# Altium project Embedded_TestBed.PrjPcb
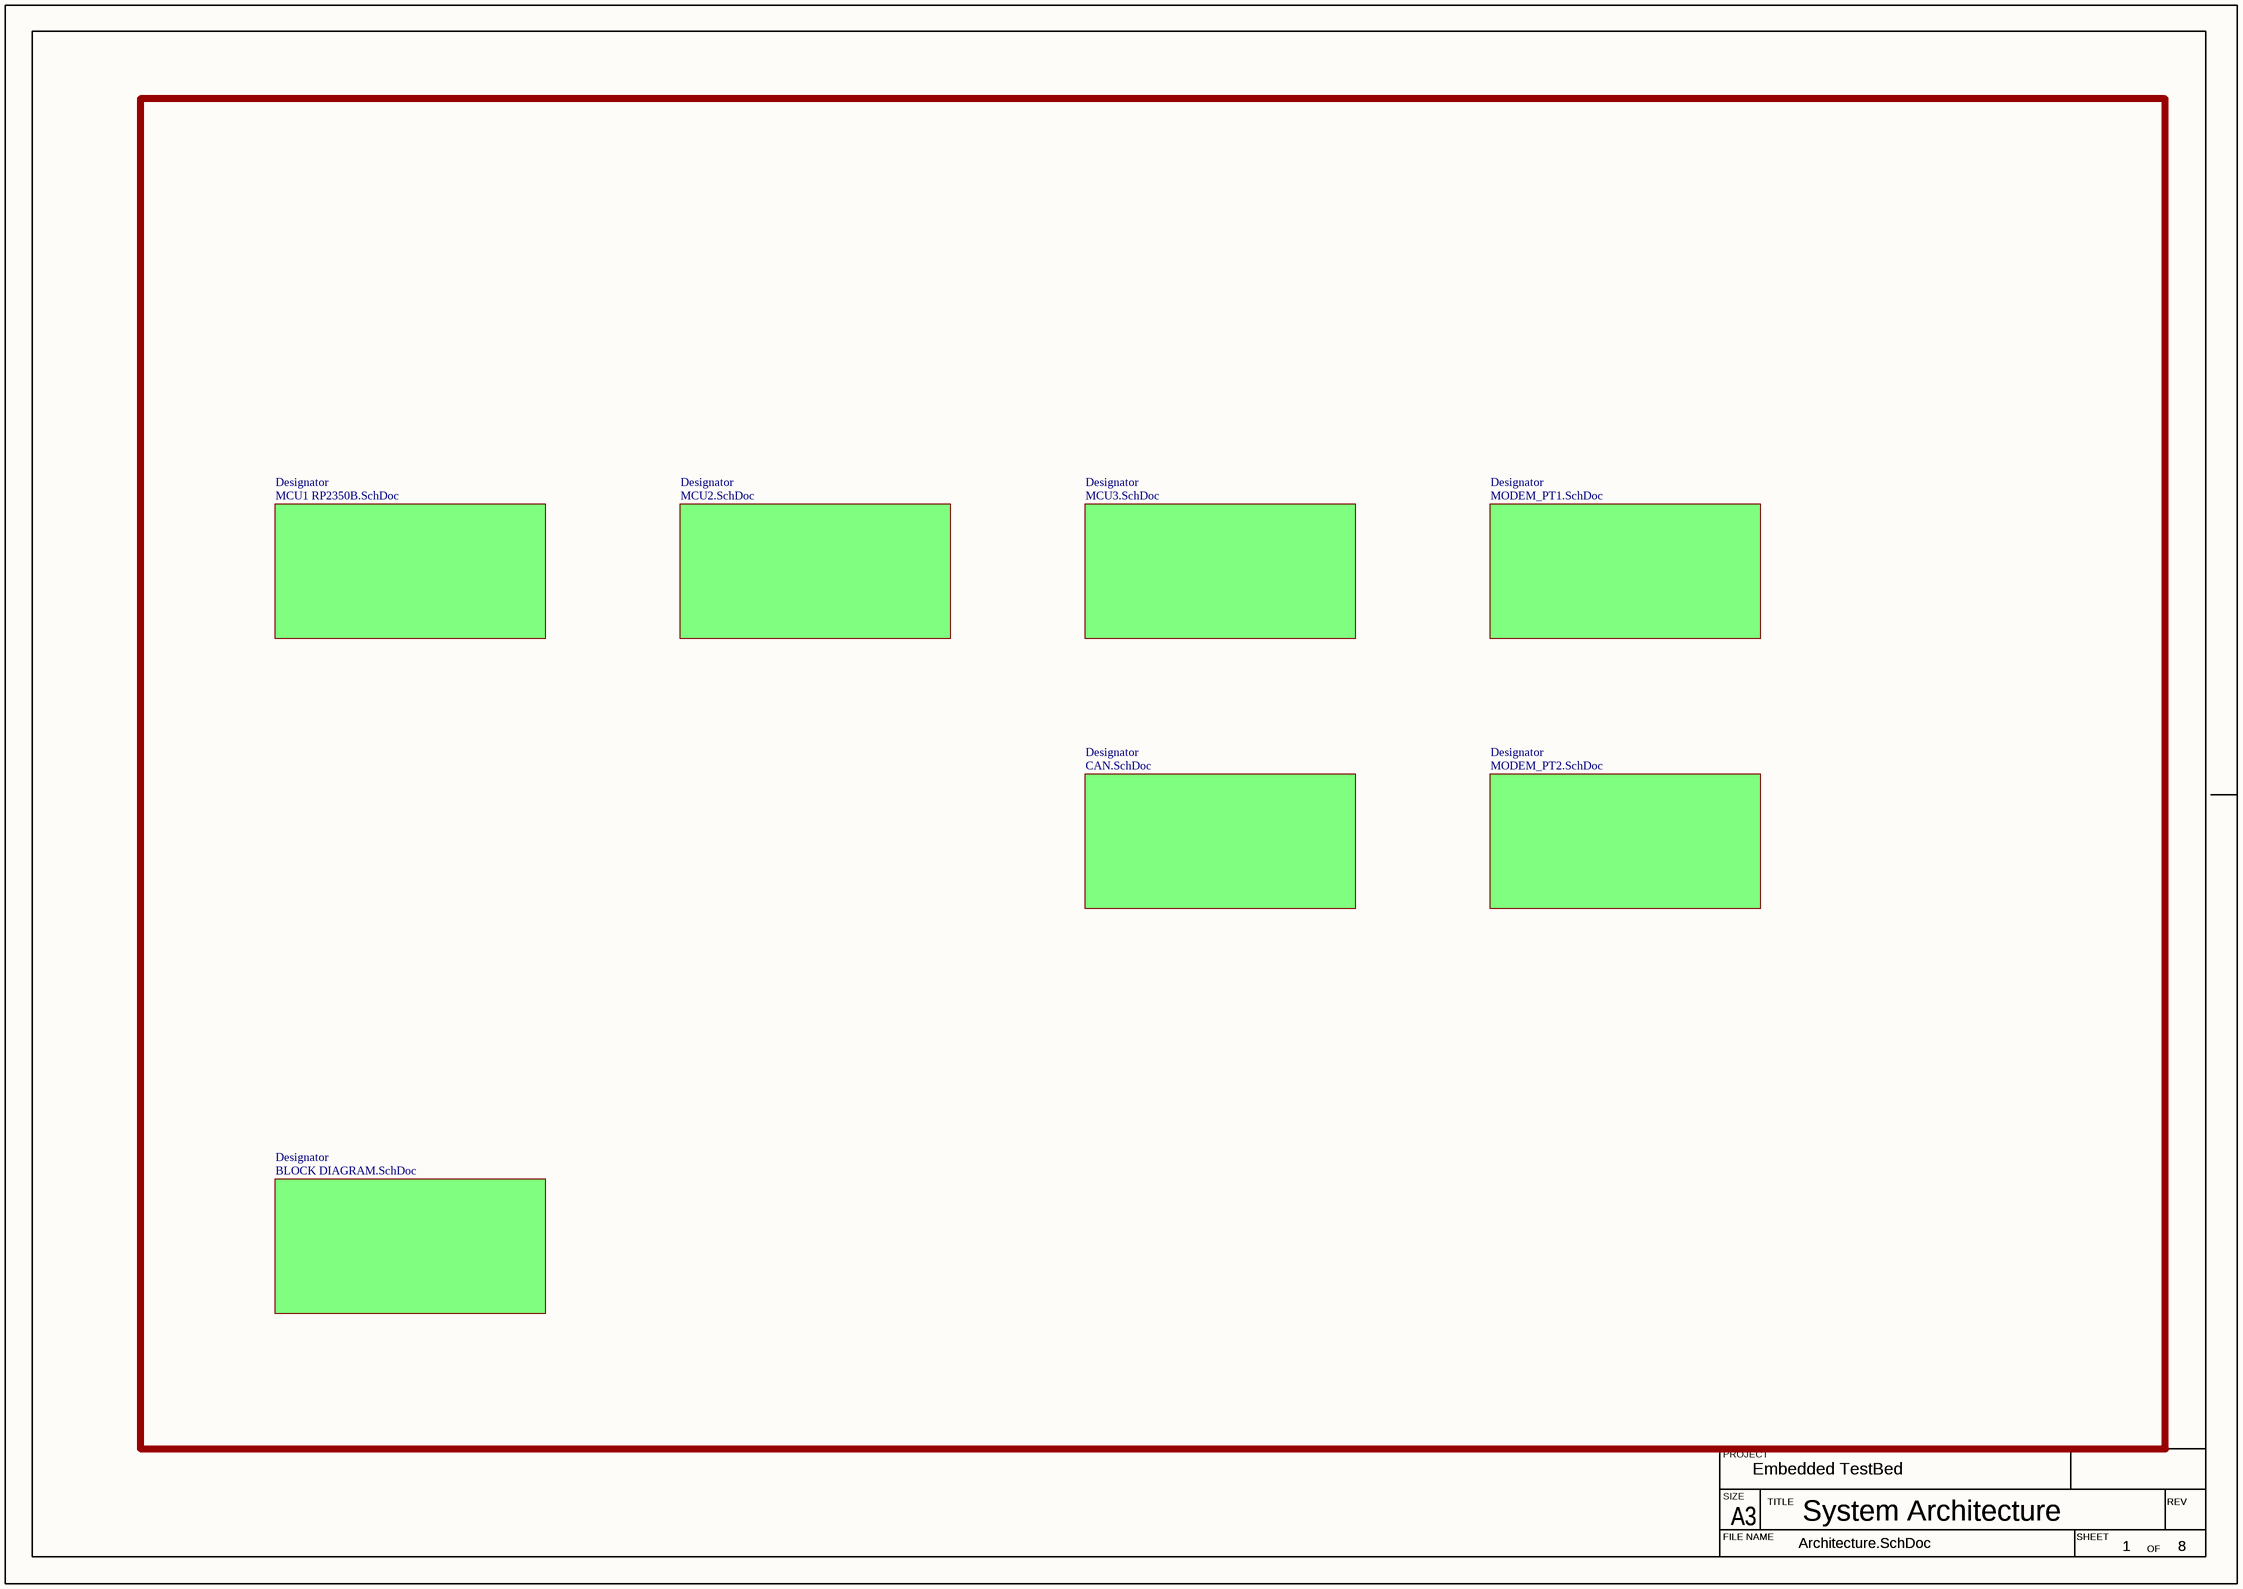
[diagram p0: Architecture.SchDoc]
Project: Embedded TestBed; Rev: 1.0
7 sheets, 141 parts. Net scope: flat (ports and power ports of the same name join across sheets).
Board file: Embedded_TestBed.PcbDoc
Sheets:
  Architecture.SchDoc
    Designator = MCU1 RP2350B.SchDoc
    Designator = MCU2.SchDoc
    Designator = MCU3.SchDoc
    Designator = MODEM_PT1.SchDoc
    Designator = MODEM_PT2.SchDoc
    Designator = CAN.SchDoc

## Sheet Architecture.SchDoc: System Architecture
size 420 x 297 mm; Revision: 1.0; SheetNumber: 1; SheetTotal: 8

### Sub-sheets
Designator = MCU1 RP2350B.SchDoc: no entries
Designator = MCU2.SchDoc: no entries
Designator = BLOCK DIAGRAM.SchDoc (file not in this document): no entries
Designator = MCU3.SchDoc: no entries
Designator = MODEM_PT1.SchDoc: no entries
Designator = MODEM_PT2.SchDoc: no entries
Designator = CAN.SchDoc: no entries

### Notes on the sheet
- PROJECT
- SIZE
- FILE NAME
- A3
- TITLE
- SHEET
- OF
- REV

## Sheet MCU1 RP2350B.SchDoc: MCU 1 - RP2350B
size 420 x 297 mm; Revision: 1.0; SheetNumber: 3; SheetTotal: 8
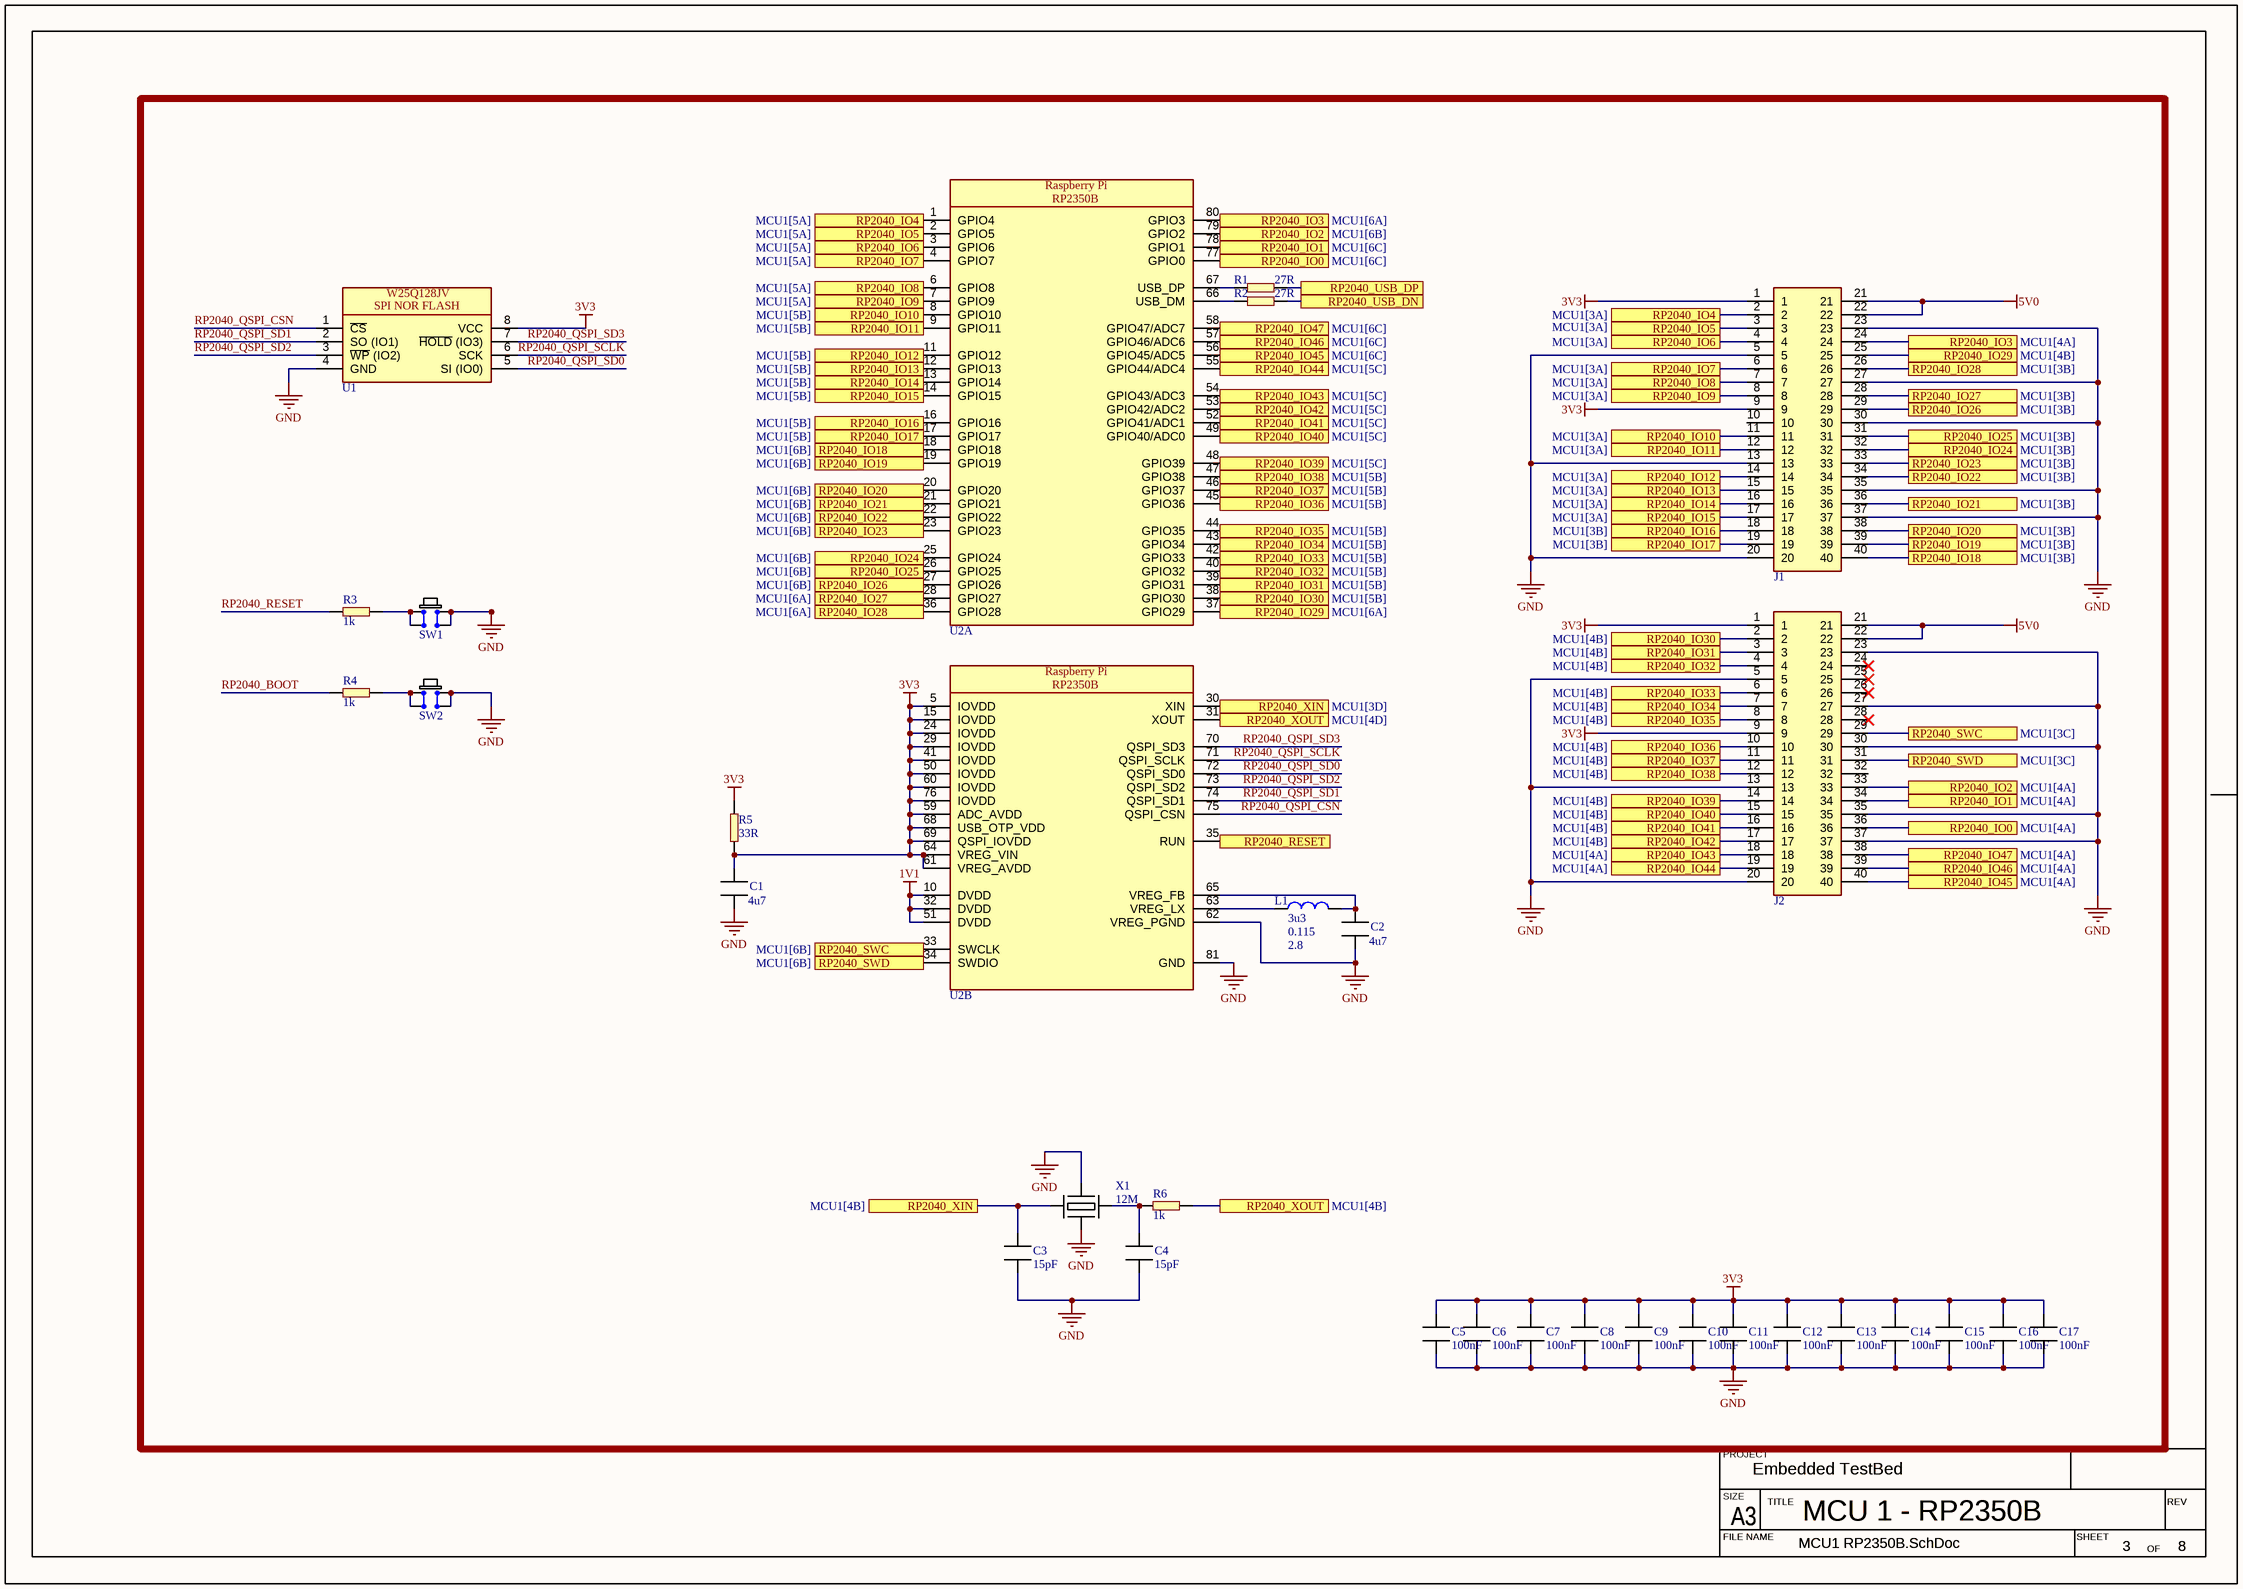
[diagram p1: MCU1 RP2350B.SchDoc]

### Parts
C1  value 4u7  [CAPC1608X10N]  (hidden comment: ERP_102-1)
C2  value 4u7  [CAPC1608X10N]  (hidden comment: ERP_102-1)
C3  value 15pF  [CAPC2012X13L]  (hidden comment: MLCC_0805)
C4  value 15pF  [CAPC2012X13L]  (hidden comment: MLCC_0805)
C5  value 100nF  [CAPC2012X13L]  (hidden comment: MLCC_0805)
C6  value 100nF  [CAPC2012X13L]  (hidden comment: MLCC_0805)
C7  value 100nF  [CAPC2012X13L]  (hidden comment: MLCC_0805)
C8  value 100nF  [CAPC2012X13L]  (hidden comment: MLCC_0805)
C9  value 100nF  [CAPC2012X13L]  (hidden comment: MLCC_0805)
C10  value 100nF  [CAPC2012X13L]  (hidden comment: MLCC_0805)
C11  value 100nF  [CAPC2012X13L]  (hidden comment: MLCC_0805)
C12  value 100nF  [CAPC2012X13L]  (hidden comment: MLCC_0805)
C13  value 100nF  [CAPC2012X13L]  (hidden comment: MLCC_0805)
C14  value 100nF  [CAPC2012X13L]  (hidden comment: MLCC_0805)
C15  value 100nF  [CAPC2012X13L]  (hidden comment: MLCC_0805)
C16  value 100nF  [CAPC2012X13L]  (hidden comment: MLCC_0805)
C17  value 100nF  [CAPC2012X13L]  (hidden comment: MLCC_0805)
J1  40PX2R_M_1  [40PX2R_Male_THT]  (value not drawn)
J2  40PX2R_M_1  [40PX2R_Male_THT]  (value not drawn)
L1  value 3u3  DCR: 0.115  ISAT: 2.8  [INDC2016X10M]  (hidden comment: AOTA-B201610S)
R1  value 27R  [RES_0805]  (hidden comment: ERP_101-1)
R2  value 27R  [RES_0805]  (hidden comment: ERP_101-1)
R3  value 1k  [RES_0805]  (hidden comment: ERP_101-1)
R4  value 1k  [RES_0805]  (hidden comment: ERP_101-1)
R5  value 33R  [RES_0603]  (hidden comment: ERP_101-1)
R6  value 1k  [RES_0805]  (hidden comment: ERP_101-1)
SW1  Generic6X6  [Generic6X6]  (value not drawn)
SW2  Generic6X6  [Generic6X6]  (value not drawn)
U1  W25Q128JV  [SOIC127P780X195-8N]  (value not drawn)
U2  RP2350B  [QFN40P1000X1000X90_HS-81M]  (value not drawn)  (parts A,B of 2)
X1  value 12M  [ABM8]  (hidden comment: ABM8)

### Ports
RP2040_IO0 (see MCU1[4A]), RP2040_IO0 (see MCU1[6C]), RP2040_IO1 (see MCU1[4A]), RP2040_IO1 (see MCU1[6C]), RP2040_IO2 (see MCU1[4A]), RP2040_IO2 (see MCU1[6B]), RP2040_IO3 (see MCU1[4A]), RP2040_IO3 (see MCU1[6A]), RP2040_IO4 (see MCU1[3A]), RP2040_IO4 (see MCU1[5A]), RP2040_IO5 (see MCU1[3A]), RP2040_IO5 (see MCU1[5A]), RP2040_IO6 (see MCU1[3A]), RP2040_IO6 (see MCU1[5A]), RP2040_IO7 (see MCU1[3A]), RP2040_IO7 (see MCU1[5A]), RP2040_IO8 (see MCU1[3A]), RP2040_IO8 (see MCU1[5A]), RP2040_IO9 (see MCU1[3A]), RP2040_IO9 (see MCU1[5A]), RP2040_IO10 (see MCU1[3A]), RP2040_IO10 (see MCU1[5B]), RP2040_IO11 (see MCU1[3A]), RP2040_IO11 (see MCU1[5B]), RP2040_IO12 (see MCU1[3A]), RP2040_IO12 (see MCU1[5B]), RP2040_IO13 (see MCU1[3A]), RP2040_IO13 (see MCU1[5B]), RP2040_IO14 (see MCU1[3A]), RP2040_IO14 (see MCU1[5B]), RP2040_IO15 (see MCU1[3A]), RP2040_IO15 (see MCU1[5B]), RP2040_IO16 (see MCU1[3B]), RP2040_IO16 (see MCU1[5B]), RP2040_IO17 (see MCU1[3B]), RP2040_IO17 (see MCU1[5B]), RP2040_IO18 (see MCU1[3B]), RP2040_IO18 (see MCU1[6B]), RP2040_IO19 (see MCU1[3B]), RP2040_IO19 (see MCU1[6B]), RP2040_IO20 (see MCU1[3B]), RP2040_IO20 (see MCU1[6B]), RP2040_IO21 (see MCU1[3B]), RP2040_IO21 (see MCU1[6B]), RP2040_IO22 (see MCU1[3B]), RP2040_IO22 (see MCU1[6B]), RP2040_IO23 (see MCU1[3B]), RP2040_IO23 (see MCU1[6B]), RP2040_IO24 (see MCU1[3B]), RP2040_IO24 (see MCU1[6B]), RP2040_IO25 (see MCU1[3B]), RP2040_IO25 (see MCU1[6B]), RP2040_IO26 (see MCU1[3B]), RP2040_IO26 (see MCU1[6B]), RP2040_IO27 (see MCU1[3B]), RP2040_IO27 (see MCU1[6A]), RP2040_IO28 (see MCU1[3B]), RP2040_IO28 (see MCU1[6A]), RP2040_IO29 (see MCU1[4B]), RP2040_IO29 (see MCU1[6A]), RP2040_IO30 (see MCU1[4B]), RP2040_IO30 (see MCU1[5B]), RP2040_IO31 (see MCU1[4B]), RP2040_IO31 (see MCU1[5B]), RP2040_IO32 (see MCU1[4B]), RP2040_IO32 (see MCU1[5B]), RP2040_IO33 (see MCU1[4B]), RP2040_IO33 (see MCU1[5B]), RP2040_IO34 (see MCU1[4B]), RP2040_IO34 (see MCU1[5B]), RP2040_IO35 (see MCU1[4B]), RP2040_IO35 (see MCU1[5B]), RP2040_IO36 (see MCU1[4B]), RP2040_IO36 (see MCU1[5B]), RP2040_IO37 (see MCU1[4B]), RP2040_IO37 (see MCU1[5B]), RP2040_IO38 (see MCU1[4B]), RP2040_IO38 (see MCU1[5B]), RP2040_IO39 (see MCU1[4B]), RP2040_IO39 (see MCU1[5C]), RP2040_IO40 (see MCU1[4B]), RP2040_IO40 (see MCU1[5C]), RP2040_IO41 (see MCU1[4B]), RP2040_IO41 (see MCU1[5C]), RP2040_IO42 (see MCU1[4B]), RP2040_IO42 (see MCU1[5C]), RP2040_IO43 (see MCU1[4A]), RP2040_IO43 (see MCU1[5C]), RP2040_IO44 (see MCU1[4A]), RP2040_IO44 (see MCU1[5C]), RP2040_IO45 (see MCU1[4A]), RP2040_IO45 (see MCU1[6C]), RP2040_IO46 (see MCU1[4A]), RP2040_IO46 (see MCU1[6C]), RP2040_IO47 (see MCU1[4A]), RP2040_IO47 (see MCU1[6C]), RP2040_RESET, RP2040_SWC (see MCU1[3C]), RP2040_SWC (see MCU1[6B]), RP2040_SWD (see MCU1[3C]), RP2040_SWD (see MCU1[6B]), RP2040_USB_DN, RP2040_USB_DP, RP2040_XIN (see MCU1[3D]), RP2040_XIN (see MCU1[4B]), RP2040_XOUT (see MCU1[4B]), RP2040_XOUT (see MCU1[4D])

### Nets
1V1: U2.10(DVDD) U2.32(DVDD) U2.51(DVDD)
3V3: C1.1 C5.1 C6.1 C7.1 C8.1 C9.1 C10.1 C11.1 C12.1 C13.1 C14.1 C15.1 C16.1 C17.1 J1.1 J1.9 J2.1 J2.9 R5.1 R5.2 U1.8(VCC) U2.5(IOVDD) U2.15(IOVDD) U2.24(IOVDD) U2.29(IOVDD) U2.41(IOVDD) U2.50(IOVDD) U2.59(ADC_AVDD) U2.60(IOVDD) U2.61(VREG_AVDD) U2.64(VREG_VIN) U2.68(USB_OTP_VDD) U2.69(QSPI_IOVDD) U2.76(IOVDD)
5V0: J1.21 J1.22 J2.21 J2.22
GND: C1.2 C2.2 C3.2 C4.2 C5.2 C6.2 C7.2 C8.2 C9.2 C10.2 C11.2 C12.2 C13.2 C14.2 C15.2 C16.2 C17.2 J1.5 J1.13 J1.20 J1.23 J1.27 J1.30 J1.35 J1.37 J2.5 J2.13 J2.20 J2.23 J2.27 J2.30 J2.35 J2.37 SW1.3(COM) SW1.4(COM) SW2.3(COM) SW2.4(COM) U1.4(GND) U2.62(VREG_PGND) U2.81(GND) X1.2 X1.4
RP2040_BOOT: R4.2
RP2040_QSPI_CSN: U1.1(~{CS}) U2.75(QSPI_CSN)
RP2040_QSPI_SCLK: U1.6(SCK) U2.71(QSPI_SCLK)
RP2040_QSPI_SD0: U1.5(SI_(IO0)) U2.72(QSPI_SD0)
RP2040_QSPI_SD1: U1.2(SO_(IO1)) U2.74(QSPI_SD1)
RP2040_QSPI_SD2: U1.3(~{WP}_(IO2)) U2.73(QSPI_SD2)
RP2040_QSPI_SD3: U1.7(~{HOLD}_(IO3)) U2.70(QSPI_SD3)
RP2040_RESET: R3.2
NetC2_1: C2.1 L1.2 U2.65(VREG_FB)
NetC3_1: C3.1 U2.30(XIN) X1.1 ; port RP2040_XIN
NetC4_1: C4.1 R6.2 X1.3
NetJ1_2: J1.2 U2.1(GPIO4) ; port RP2040_IO4
NetJ1_3: J1.3 U2.2(GPIO5) ; port RP2040_IO5
NetJ1_4: J1.4 U2.3(GPIO6) ; port RP2040_IO6
NetJ1_6: J1.6 U2.4(GPIO7) ; port RP2040_IO7
NetJ1_7: J1.7 U2.6(GPIO8) ; port RP2040_IO8
NetJ1_8: J1.8 U2.7(GPIO9) ; port RP2040_IO9
NetJ1_11: J1.11 U2.8(GPIO10) ; port RP2040_IO10
NetJ1_12: J1.12 U2.9(GPIO11) ; port RP2040_IO11
NetJ1_14: J1.14 U2.11(GPIO12) ; port RP2040_IO12
NetJ1_15: J1.15 U2.12(GPIO13) ; port RP2040_IO13
NetJ1_16: J1.16 U2.13(GPIO14) ; port RP2040_IO14
NetJ1_17: J1.17 U2.14(GPIO15) ; port RP2040_IO15
NetJ1_18: J1.18 U2.16(GPIO16) ; port RP2040_IO16
NetJ1_19: J1.19 U2.17(GPIO17) ; port RP2040_IO17
NetJ1_24: J1.24 U2.80(GPIO3) ; port RP2040_IO3
NetJ1_25: J1.25 U2.37(GPIO29) ; port RP2040_IO29
NetJ1_26: J1.26 U2.36(GPIO28) ; port RP2040_IO28
NetJ1_28: J1.28 U2.28(GPIO27) ; port RP2040_IO27
NetJ1_29: J1.29 U2.27(GPIO26) ; port RP2040_IO26
NetJ1_31: J1.31 U2.26(GPIO25) ; port RP2040_IO25
NetJ1_32: J1.32 U2.25(GPIO24) ; port RP2040_IO24
NetJ1_33: J1.33 U2.23(GPIO23) ; port RP2040_IO23
NetJ1_34: J1.34 U2.22(GPIO22) ; port RP2040_IO22
NetJ1_36: J1.36 U2.21(GPIO21) ; port RP2040_IO21
NetJ1_38: J1.38 U2.20(GPIO20) ; port RP2040_IO20
NetJ1_39: J1.39 U2.19(GPIO19) ; port RP2040_IO19
NetJ1_40: J1.40 U2.18(GPIO18) ; port RP2040_IO18
NetJ2_2: J2.2 U2.38(GPIO30) ; port RP2040_IO30
NetJ2_3: J2.3 U2.39(GPIO31) ; port RP2040_IO31
NetJ2_4: J2.4 U2.40(GPIO32) ; port RP2040_IO32
NetJ2_6: J2.6 U2.42(GPIO33) ; port RP2040_IO33
NetJ2_7: J2.7 U2.43(GPIO34) ; port RP2040_IO34
NetJ2_8: J2.8 U2.44(GPIO35) ; port RP2040_IO35
NetJ2_10: J2.10 U2.45(GPIO36) ; port RP2040_IO36
NetJ2_11: J2.11 U2.46(GPIO37) ; port RP2040_IO37
NetJ2_12: J2.12 U2.47(GPIO38) ; port RP2040_IO38
NetJ2_14: J2.14 U2.48(GPIO39) ; port RP2040_IO39
NetJ2_15: J2.15 U2.49(GPIO40/ADC0) ; port RP2040_IO40
NetJ2_16: J2.16 U2.52(GPIO41/ADC1) ; port RP2040_IO41
NetJ2_17: J2.17 U2.53(GPIO42/ADC2) ; port RP2040_IO42
NetJ2_18: J2.18 U2.54(GPIO43/ADC3) ; port RP2040_IO43
NetJ2_19: J2.19 U2.55(GPIO44/ADC4) ; port RP2040_IO44
NetJ2_29: J2.29 U2.33(SWCLK) ; port RP2040_SWC
NetJ2_31: J2.31 U2.34(SWDIO) ; port RP2040_SWD
NetJ2_33: J2.33 U2.79(GPIO2) ; port RP2040_IO2
NetJ2_34: J2.34 U2.78(GPIO1) ; port RP2040_IO1
NetJ2_36: J2.36 U2.77(GPIO0) ; port RP2040_IO0
NetJ2_38: J2.38 U2.58(GPIO47/ADC7) ; port RP2040_IO47
NetJ2_39: J2.39 U2.57(GPIO46/ADC6) ; port RP2040_IO46
NetJ2_40: J2.40 U2.56(GPIO45/ADC5) ; port RP2040_IO45
NetL1_1: L1.1 U2.63(VREG_LX)
NetR1_1: R1.1 ; port RP2040_USB_DP
NetR1_2: R1.2 U2.67(USB_DP)
NetR2_1: R2.1 ; port RP2040_USB_DN
NetR2_2: R2.2 U2.66(USB_DM)
NetR3_1: R3.1 SW1.1(NO) SW1.2(NO)
NetR4_1: R4.1 SW2.1(NO) SW2.2(NO)
NetR6_1: R6.1 U2.31(XOUT) ; port RP2040_XOUT
NetU2_35: U2.35(RUN) ; port RP2040_RESET

Not connected (* = marked no-connect by the designer): J1 10; J2 24* 25* 26* 28* 32

### Notes on the sheet
- PROJECT
- SIZE
- FILE NAME
- A3
- TITLE
- SHEET
- OF
- REV
- (in symbol W25Q128JV) SPI NOR FLASH

### Library data of the parts
C1 C2 = MLCC_0603: Chip Capacitor, 2-Leads, Body 1.60x0.80mm, IPC Medium Density; Package: 0603; Manufacturer 1: *; Manufacturer Part Number 1: *
C3-C17 = MLCC_0805: Chip Capacitor, 2-Leads, Body 2.00x1.25mm, IPC High Density; Package: 0805; Manufacturer 1: *; Manufacturer Part Number 1: *
J1 J2 = 40PX2R_M_1: Berg Connector Header Through Hole  40 Position 0.100" (2.54mm); Manufacturer 1: CNC Tech; Value: *; Manufacturer Part Number 1: *
L1 = AOTA-B201610S: AOTA-B201610S Abracon 2.0 x 1.6 MM; Manufacturer Part Number 1: AOTA-B201610S3R3-101-T; Manufacturer 1: Abracon
R1-R4 R6 = RES_0805: Package: 0805; Manufacturer 1: *; Manufacturer Part Number 1: *
R5 = RES_0603: Package: 0603; Manufacturer 1: *; Manufacturer Part Number 1: *
SW1 SW2 = Generic6X6: Tactile Switch SPST-NO Top Actuated Surface Mount; Manufacturer 1: C&K; Manufacturer Part Number 1: *; Package: 4.5X4.5
U1 = W25Q128JV: FLASH - NOR Memory IC SPI - Quad I/O 133 MHz 8-SOIC; Manufacturer 1: Winbond; Manufacturer Part Number 1: W25Q128JVSIQ; Value: 16M; Package: 8-SOIC
U2 = RP2350B: Dual ARM Cortex M33 - Microcontroller IC 32-Bit 80-QFN (10x10); Manufacturer Part Number 1: RP2040; Manufacturer 1: Raspberry Pi; Package: QFN56; Value: *; Supplier Part Number 1: *; Supplier 1: *
X1 = ABM8: CRYS_L3.2_W2.5; Manufacturer Part Number 1: ABM8-272-T3; Manufacturer 1: Abracon LLC

## Sheet MCU2.SchDoc: MCU 2 - ESP32S3
size 420 x 297 mm; Revision: 1.0; SheetNumber: 4; SheetTotal: 8
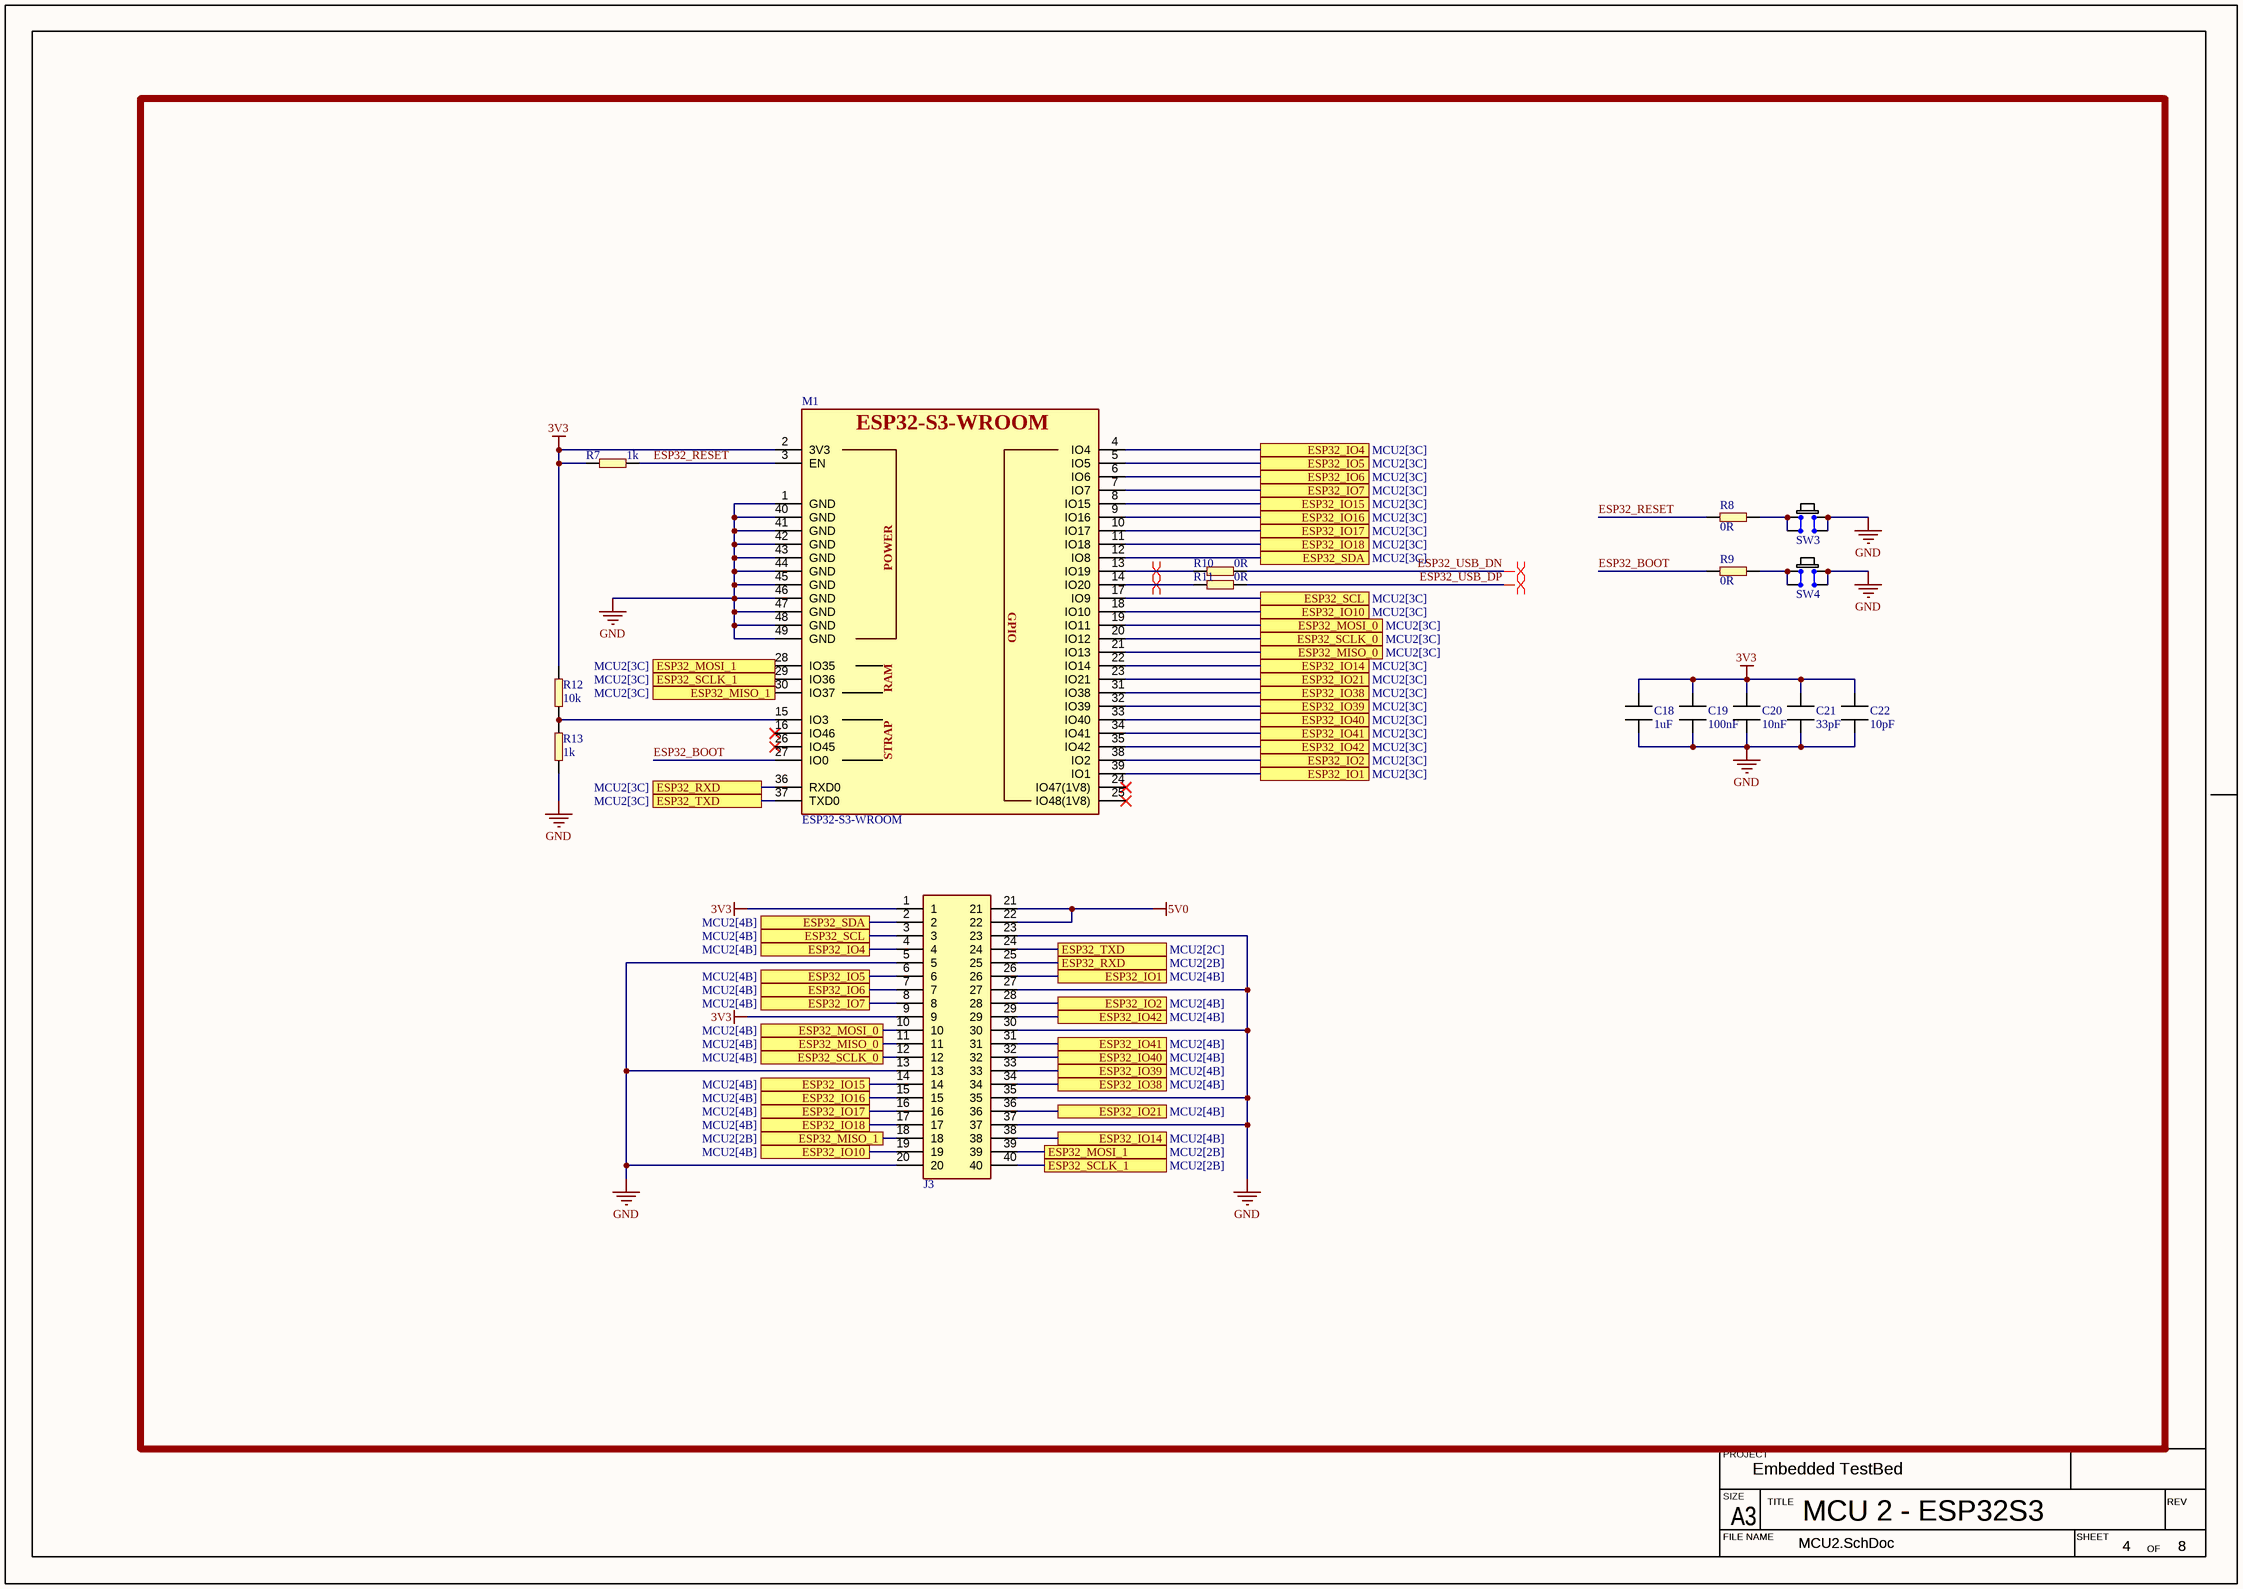
[diagram p2: MCU2.SchDoc]

### Parts
C18  value 1uF  [CAPC2012X13L]  (hidden comment: MLCC_0805)
C19  value 100nF  [CAPC2012X13L]  (hidden comment: MLCC_0805)
C20  value 10nF  [CAPC2012X13L]  (hidden comment: MLCC_0805)
C21  value 33pF  [CAPC2012X13L]  (hidden comment: MLCC_0805)
C22  value 10pF  [CAPC2012X13L]  (hidden comment: MLCC_0805)
J3  40PX2R_M_1  [40PX2R_Male_THT]  (value not drawn)
M1  ESP32-S3-WROOM  [ESP32-S3-WROOM-1U]
R7  value 1k  [RES_0805]  (hidden comment: ERP_101-1)
R8  value 0R  [RES_0805]  (hidden comment: ERP_101-1)
R9  value 0R  [RES_0805]  (hidden comment: ERP_101-1)
R10  value 0R  [RES_0805]  (hidden comment: ERP_101-1)
R11  value 0R  [RES_0805]  (hidden comment: ERP_101-1)
R12  value 10k  [RES_0805]  (hidden comment: ERP_101-1)
R13  value 1k  [RES_0805]  (hidden comment: ERP_101-1)
SW3  Generic6X6  [Generic6X6]  (value not drawn)
SW4  Generic6X6  [Generic6X6]  (value not drawn)

### Ports
ESP32_IO1 (see MCU2[3C]), ESP32_IO1 (see MCU2[4B]), ESP32_IO2 (see MCU2[3C]), ESP32_IO2 (see MCU2[4B]), ESP32_IO4 (see MCU2[3C]), ESP32_IO4 (see MCU2[4B]), ESP32_IO5 (see MCU2[3C]), ESP32_IO5 (see MCU2[4B]), ESP32_IO6 (see MCU2[3C]), ESP32_IO6 (see MCU2[4B]), ESP32_IO7 (see MCU2[3C]), ESP32_IO7 (see MCU2[4B]), ESP32_IO10 (see MCU2[3C]), ESP32_IO10 (see MCU2[4B]), ESP32_IO14 (see MCU2[3C]), ESP32_IO14 (see MCU2[4B]), ESP32_IO15 (see MCU2[3C]), ESP32_IO15 (see MCU2[4B]), ESP32_IO16 (see MCU2[3C]), ESP32_IO16 (see MCU2[4B]), ESP32_IO17 (see MCU2[3C]), ESP32_IO17 (see MCU2[4B]), ESP32_IO18 (see MCU2[3C]), ESP32_IO18 (see MCU2[4B]), ESP32_IO21 (see MCU2[3C]), ESP32_IO21 (see MCU2[4B]), ESP32_IO38 (see MCU2[3C]), ESP32_IO38 (see MCU2[4B]), ESP32_IO39 (see MCU2[3C]), ESP32_IO39 (see MCU2[4B]), ESP32_IO40 (see MCU2[3C]), ESP32_IO40 (see MCU2[4B]), ESP32_IO41 (see MCU2[3C]), ESP32_IO41 (see MCU2[4B]), ESP32_IO42 (see MCU2[3C]), ESP32_IO42 (see MCU2[4B]), ESP32_MISO_0 (see MCU2[3C]), ESP32_MISO_0 (see MCU2[4B]), ESP32_MISO_1 (see MCU2[2B]), ESP32_MISO_1 (see MCU2[3C]), ESP32_MOSI_0 (see MCU2[3C]), ESP32_MOSI_0 (see MCU2[4B]), ESP32_MOSI_1 (see MCU2[2B]), ESP32_MOSI_1 (see MCU2[3C]), ESP32_RXD (see MCU2[2B]), ESP32_RXD (see MCU2[3C]), ESP32_SCL (see MCU2[3C]), ESP32_SCL (see MCU2[4B]), ESP32_SCLK_0 (see MCU2[3C]), ESP32_SCLK_0 (see MCU2[4B]), ESP32_SCLK_1 (see MCU2[2B]), ESP32_SCLK_1 (see MCU2[3C]), ESP32_SDA (see MCU2[3C]), ESP32_SDA (see MCU2[4B]), ESP32_TXD (see MCU2[2C]), ESP32_TXD (see MCU2[3C])

### Nets
3V3: C18.1 C19.1 C20.1 C21.1 C22.1 J3.1 J3.9 M1.2(3V3) R7.2 R12.2
5V0: J3.21 J3.22
GND: C18.2 C19.2 C20.2 C21.2 C22.2 J3.5 J3.13 J3.20 J3.23 J3.27 J3.30 J3.35 J3.37 M1.1(GND) M1.40(GND) M1.41(GND) M1.42(GND) M1.43(GND) M1.44(GND) M1.45(GND) M1.46(GND) M1.47(GND) M1.48(GND) M1.49(GND) R13.2 SW3.3(COM) SW3.4(COM) SW4.3(COM) SW4.4(COM)
ESP32_BOOT: M1.27(IO0) R9.2
ESP32_RESET: M1.3(EN) R7.1 R8.2
ESP32_USB_DN: R10.1
ESP32_USB_DP: R11.1
NetJ3_2: J3.2 M1.12(IO8) ; port ESP32_SDA
NetJ3_3: J3.3 M1.17(IO9) ; port ESP32_SCL
NetJ3_4: J3.4 M1.4(IO4) ; port ESP32_IO4
NetJ3_6: J3.6 M1.5(IO5) ; port ESP32_IO5
NetJ3_7: J3.7 M1.6(IO6) ; port ESP32_IO6
NetJ3_8: J3.8 M1.7(IO7) ; port ESP32_IO7
NetJ3_10: J3.10 M1.19(IO11) ; port ESP32_MOSI_0
NetJ3_11: J3.11 M1.21(IO13) ; port ESP32_MISO_0
NetJ3_12: J3.12 M1.20(IO12) ; port ESP32_SCLK_0
NetJ3_14: J3.14 M1.8(IO15) ; port ESP32_IO15
NetJ3_15: J3.15 M1.9(IO16) ; port ESP32_IO16
NetJ3_16: J3.16 M1.10(IO17) ; port ESP32_IO17
NetJ3_17: J3.17 M1.11(IO18) ; port ESP32_IO18
NetJ3_18: J3.18 M1.30(IO37) ; port ESP32_MISO_1
NetJ3_19: J3.19 M1.18(IO10) ; port ESP32_IO10
NetJ3_24: J3.24 M1.37(TXD0) ; port ESP32_TXD
NetJ3_25: J3.25 M1.36(RXD0) ; port ESP32_RXD
NetJ3_26: J3.26 M1.39(IO1) ; port ESP32_IO1
NetJ3_28: J3.28 M1.38(IO2) ; port ESP32_IO2
NetJ3_29: J3.29 M1.35(IO42) ; port ESP32_IO42
NetJ3_31: J3.31 M1.34(IO41) ; port ESP32_IO41
NetJ3_32: J3.32 M1.33(IO40) ; port ESP32_IO40
NetJ3_33: J3.33 M1.32(IO39) ; port ESP32_IO39
NetJ3_34: J3.34 M1.31(IO38) ; port ESP32_IO38
NetJ3_36: J3.36 M1.23(IO21) ; port ESP32_IO21
NetJ3_38: J3.38 M1.22(IO14) ; port ESP32_IO14
NetJ3_39: J3.39 M1.28(IO35) ; port ESP32_MOSI_1
NetJ3_40: J3.40 M1.29(IO36) ; port ESP32_SCLK_1
NetM1_13: M1.13(IO19) R10.2
NetM1_14: M1.14(IO20) R11.2
NetM1_15: M1.15(IO3) R12.1 R13.1
NetR8_1: R8.1 SW3.1(NO) SW3.2(NO)
NetR9_1: R9.1 SW4.1(NO) SW4.2(NO)

Not connected (* = marked no-connect by the designer): M1 16(IO46)* 24(IO47(1V8))* 25(IO48(1V8))* 26(IO45)*

### Layout directives
differential pair; rule Differential Pairs Routing [Pref Gap = 31.496mil    Min Gap  = 31.496mil    Max Gap  = 31.496milPref Width = 10mil    Min Width  = 10mil    Max Width  = 10mil]: NetM1_13, NetM1_14
rule Differential Pairs Routing [Pref Gap = 31.496mil    Min Gap  = 31.496mil    Max Gap  = 31.496milPref Width = 10mil    Min Width  = 10mil    Max Width  = 10mil]: ESP32_USB_DN, ESP32_USB_DP

### Notes on the sheet
- PROJECT
- SIZE
- FILE NAME
- A3
- TITLE
- SHEET
- OF
- REV
- (in symbol ESP32-S3-WROOM) POWER; GPIO; RAM; STRAP

### Library data of the parts
C18-C22 = MLCC_0805: as C3 on sheet MCU1 RP2350B; Package: 0805; Manufacturer 1: *; Manufacturer Part Number 1: *
J3 = 40PX2R_M_1: as J1 on sheet MCU1 RP2350B; Value: *; Manufacturer Part Number 1: *
M1 = ESP32-S3-WROOM: ESP32-S3-WROOM Module; Manufacturer 1: Espressif Systems; Manufacturer Part Number 1: *; Package: *; Value: ESP32-S3-WROOM
R7-R13 = RES_0805: Package: 0805; Manufacturer 1: *; Manufacturer Part Number 1: *
SW3 SW4 = Generic6X6: as SW1 on sheet MCU1 RP2350B; Manufacturer Part Number 1: *; Package: 4.5X4.5

## Sheet MCU3.SchDoc: MCU 3 - STM32G4
size 420 x 297 mm; Revision: 1.0; SheetNumber: 5; SheetTotal: 8
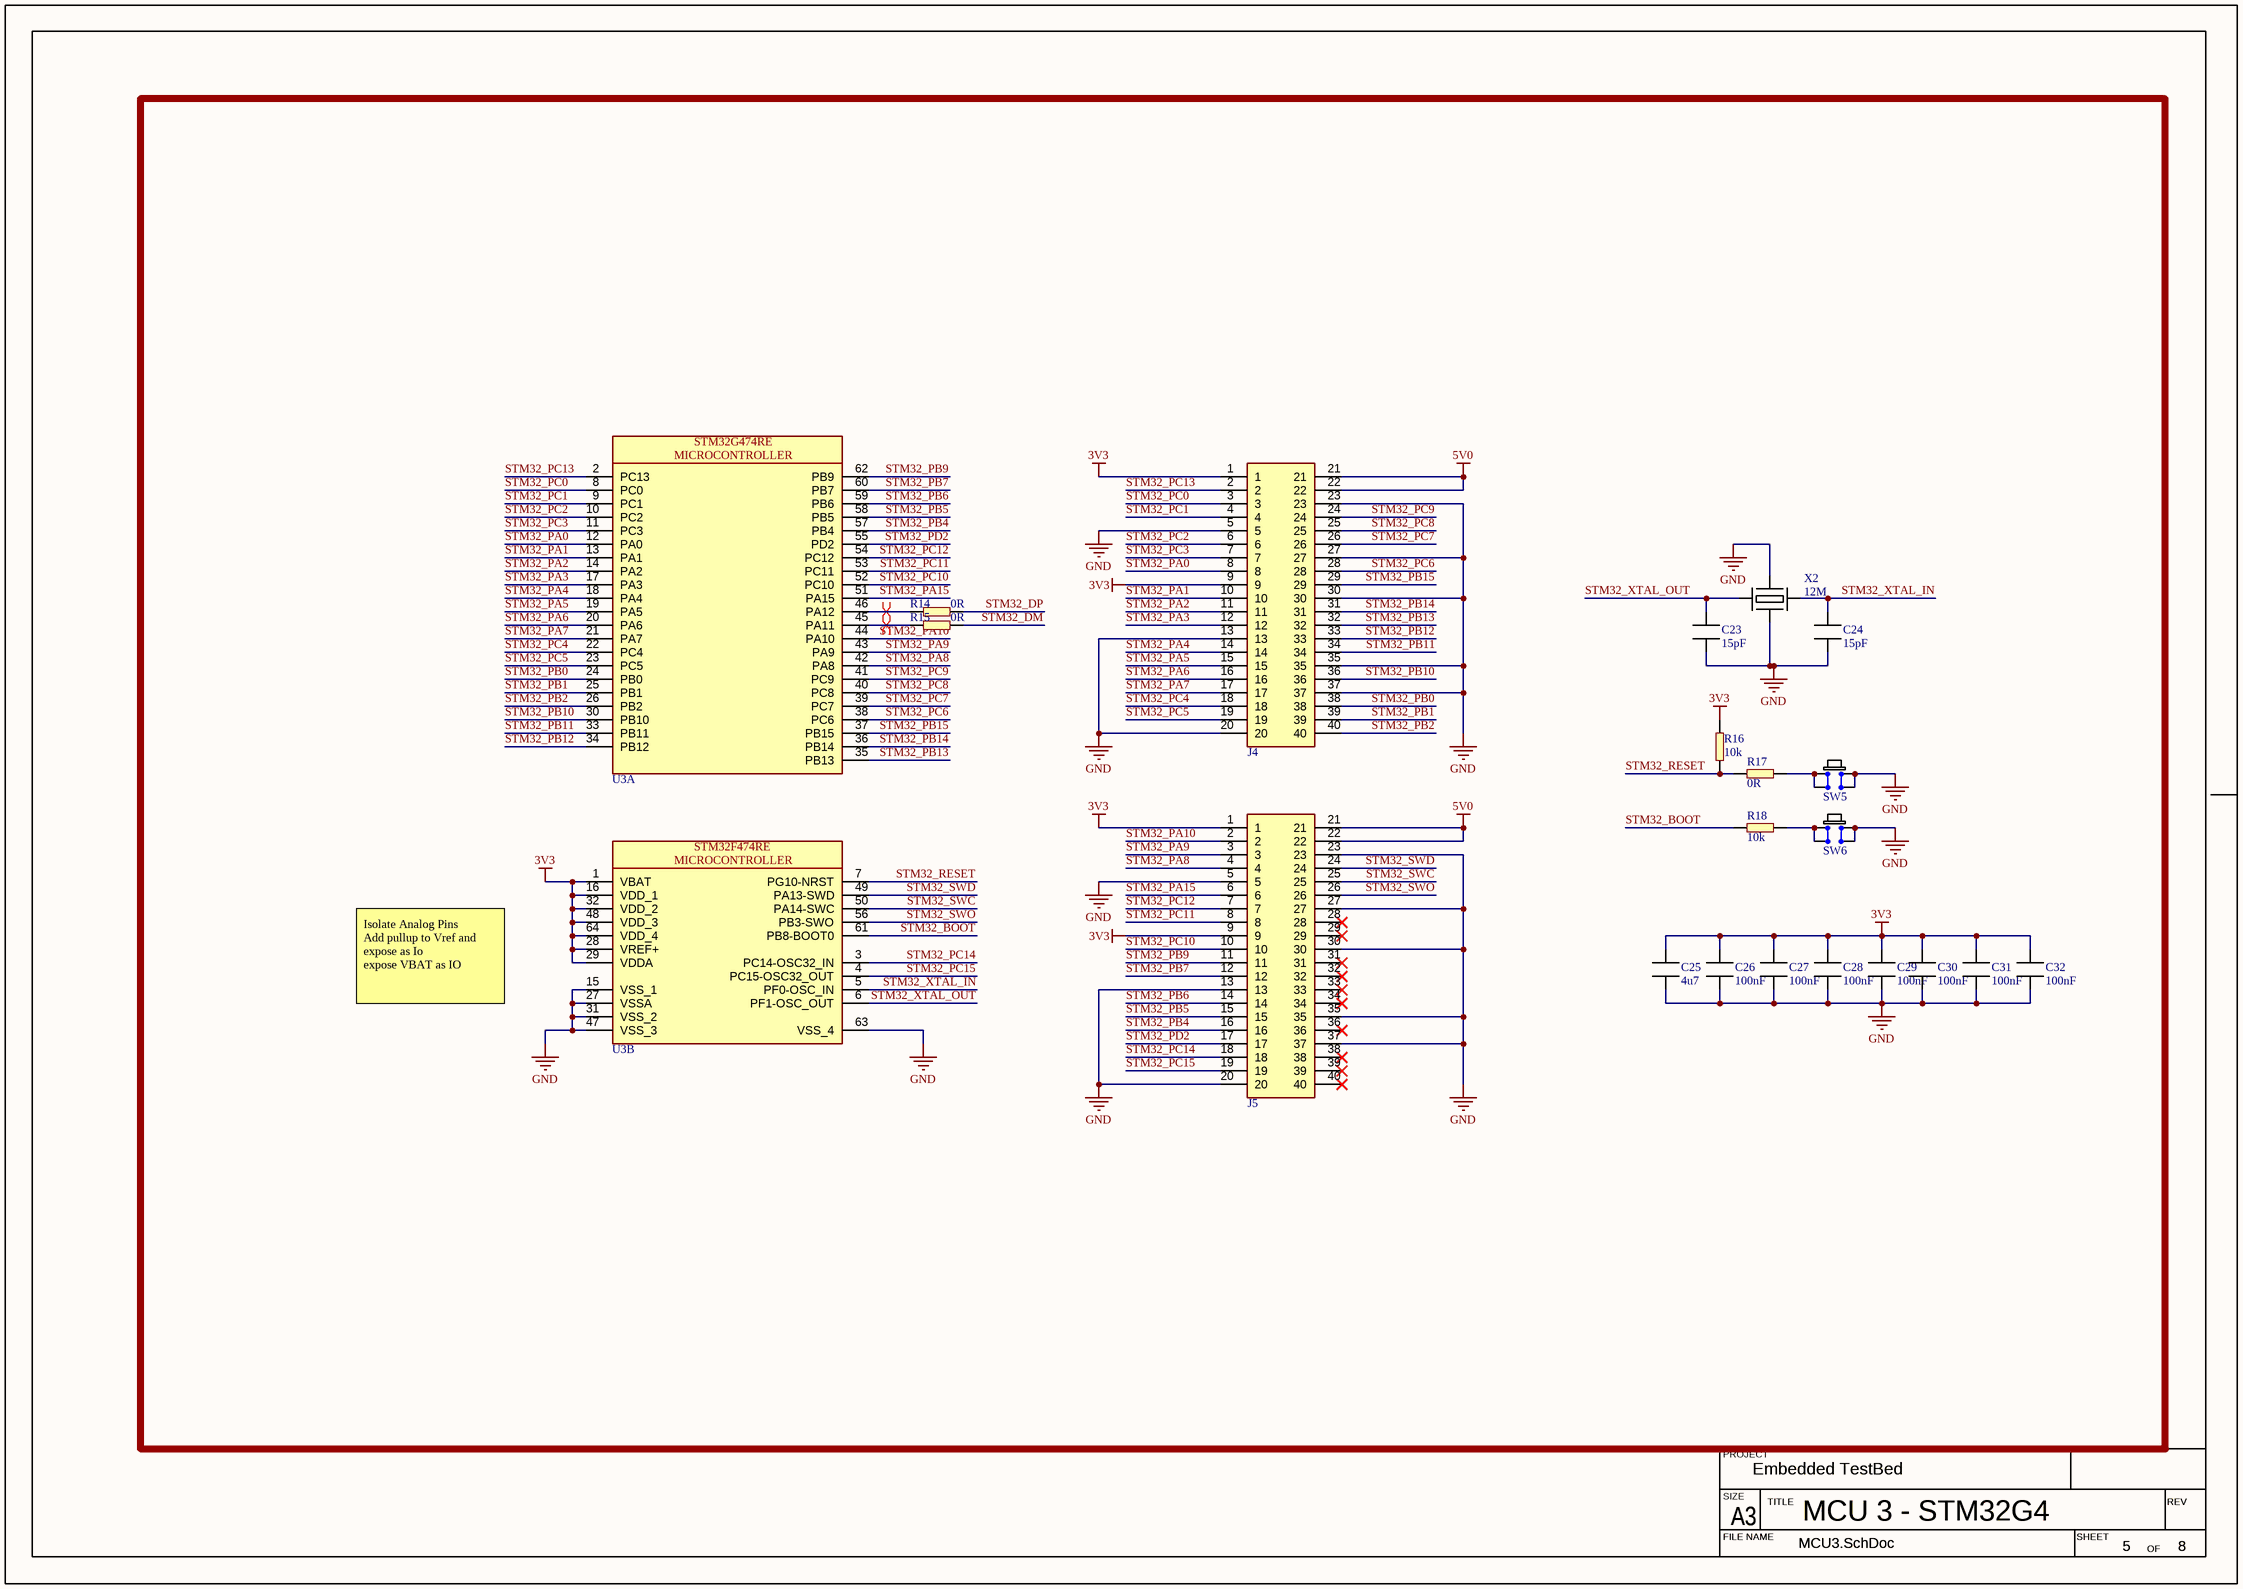
[diagram p3: MCU3.SchDoc]

### Parts
C23  value 15pF  [CAPC2012X13L]  (hidden comment: MLCC_0805)
C24  value 15pF  [CAPC2012X13L]  (hidden comment: MLCC_0805)
C25  value 4u7  [CAPC2012X13L]  (hidden comment: MLCC_0805)
C26  value 100nF  [CAPC2012X13L]  (hidden comment: MLCC_0805)
C27  value 100nF  [CAPC2012X13L]  (hidden comment: MLCC_0805)
C28  value 100nF  [CAPC2012X13L]  (hidden comment: MLCC_0805)
C29  value 100nF  [CAPC2012X13L]  (hidden comment: MLCC_0805)
C30  value 100nF  [CAPC2012X13L]  (hidden comment: MLCC_0805)
C31  value 100nF  [CAPC2012X13L]  (hidden comment: MLCC_0805)
C32  value 100nF  [CAPC2012X13L]  (hidden comment: MLCC_0805)
J4  40PX2R_M_1  [40PX2R_Male_THT]  (value not drawn)
J5  40PX2R_M_1  [40PX2R_Male_THT]  (value not drawn)
R14  value 0R  [RES_0805]  (hidden comment: ERP_101-1)
R15  value 0R  [RES_0805]  (hidden comment: ERP_101-1)
R16  value 10k  [RES_0805]  (hidden comment: ERP_101-1)
R17  value 0R  [RES_0805]  (hidden comment: ERP_101-1)
R18  value 10k  [RES_0805]  (hidden comment: ERP_101-1)
SW5  Generic6X6  [Generic6X6]  (value not drawn)
SW6  Generic6X6  [Generic6X6]  (value not drawn)
U3  STM32G474RE  [TSQFP50P1200X1200X160-64L]  (value not drawn)  (parts A,B of 2)
X2  value 12M  [ABM8]  (hidden comment: ABM8)

### Nets
3V3: C25.1 C26.1 C27.1 C28.1 C29.1 C30.1 C31.1 C32.1 J4.1 J4.9 J5.1 J5.9 R16.1 U3.1(VBAT) U3.16(VDD_1) U3.28(VREF+) U3.29(VDDA) U3.32(VDD_2) U3.48(VDD_3) U3.64(VDD_4)
5V0: J4.21 J4.22 J5.21 J5.22
GND: C23.2 C24.2 C25.2 C26.2 C27.2 C28.2 C29.2 C30.2 C31.2 C32.2 J4.5 J4.13 J4.20 J4.23 J4.27 J4.30 J4.35 J4.37 J5.5 J5.13 J5.20 J5.23 J5.27 J5.30 J5.35 J5.37 SW5.3(COM) SW5.4(COM) SW6.3(COM) SW6.4(COM) U3.15(VSS_1) U3.27(VSSA) U3.31(VSS_2) U3.47(VSS_3) U3.63(VSS_4) X2.2 X2.4
STM32_BOOT: R18.2 U3.61(PB8-BOOT0)
STM32_DM: R15.1
STM32_DP: R14.1
STM32_PA0: J4.8 U3.12(PA0)
STM32_PA1: J4.10 U3.13(PA1)
STM32_PA2: J4.11 U3.14(PA2)
STM32_PA3: J4.12 U3.17(PA3)
STM32_PA4: J4.14 U3.18(PA4)
STM32_PA5: J4.15 U3.19(PA5)
STM32_PA6: J4.16 U3.20(PA6)
STM32_PA7: J4.17 U3.21(PA7)
STM32_PA8: J5.4 U3.42(PA8)
STM32_PA9: J5.3 U3.43(PA9)
STM32_PA10: J5.2 U3.44(PA10)
STM32_PA15: J5.6 U3.51(PA15)
STM32_PB0: J4.38 U3.24(PB0)
STM32_PB1: J4.39 U3.25(PB1)
STM32_PB2: J4.40 U3.26(PB2)
STM32_PB4: J5.16 U3.57(PB4)
STM32_PB5: J5.15 U3.58(PB5)
STM32_PB6: J5.14 U3.59(PB6)
STM32_PB7: J5.12 U3.60(PB7)
STM32_PB9: J5.11 U3.62(PB9)
STM32_PB10: J4.36 U3.30(PB10)
STM32_PB11: J4.34 U3.33(PB11)
STM32_PB12: J4.33 U3.34(PB12)
STM32_PB13: J4.32 U3.35(PB13)
STM32_PB14: J4.31 U3.36(PB14)
STM32_PB15: J4.29 U3.37(PB15)
STM32_PC0: J4.3 U3.8(PC0)
STM32_PC1: J4.4 U3.9(PC1)
STM32_PC2: J4.6 U3.10(PC2)
STM32_PC3: J4.7 U3.11(PC3)
STM32_PC4: J4.18 U3.22(PC4)
STM32_PC5: J4.19 U3.23(PC5)
STM32_PC6: J4.28 U3.38(PC6)
STM32_PC7: J4.26 U3.39(PC7)
STM32_PC8: J4.25 U3.40(PC8)
STM32_PC9: J4.24 U3.41(PC9)
STM32_PC10: J5.10 U3.52(PC10)
STM32_PC11: J5.8 U3.53(PC11)
STM32_PC12: J5.7 U3.54(PC12)
STM32_PC13: J4.2 U3.2(PC13)
STM32_PC14: J5.18 U3.3(PC14-OSC32_IN)
STM32_PC15: J5.19 U3.4(PC15-OSC32_OUT)
STM32_PD2: J5.17 U3.55(PD2)
STM32_RESET: R16.2 R17.2 U3.7(PG10-NRST)
STM32_SWC: J5.25 U3.50(PA14-SWC)
STM32_SWD: J5.24 U3.49(PA13-SWD)
STM32_SWO: J5.26 U3.56(PB3-SWO)
STM32_XTAL_IN: C24.1 U3.5(PF0-OSC_IN) X2.3
STM32_XTAL_OUT: C23.1 U3.6(PF1-OSC_OUT) X2.1
NetR14_2: R14.2 U3.46(PA12)
NetR15_2: R15.2 U3.45(PA11)
NetR17_1: R17.1 SW5.1(NO) SW5.2(NO)
NetR18_1: R18.1 SW6.1(NO) SW6.2(NO)

Not connected (* = marked no-connect by the designer): J5 28* 29* 31* 32* 33* 34* 36* 38* 39* 40*

### Layout directives
differential pair; rule Differential Pairs Routing [Pref Gap = 31.496mil    Min Gap  = 31.496mil    Max Gap  = 31.496milPref Width = 10mil    Min Width  = 10mil    Max Width  = 10mil]: NetR14_2, NetR15_2

### Notes on the sheet
- Isolate Analog Pins
  Add pullup to Vref and expose as Io
  expose VBAT as IO
- PROJECT
- SIZE
- FILE NAME
- A3
- TITLE
- SHEET
- OF
- REV
- (in symbol STM32G474RE, part A) MICROCONTROLLER
- (in symbol STM32G474RE, part B) STM32F474RE; MICROCONTROLLER

### Library data of the parts
C23-C32 = MLCC_0805: as C3 on sheet MCU1 RP2350B; Package: 0805; Manufacturer 1: *; Manufacturer Part Number 1: *
J4 J5 = 40PX2R_M_1: as J1 on sheet MCU1 RP2350B; Value: *; Manufacturer Part Number 1: *
R14-R18 = RES_0805: Package: 0805; Manufacturer 1: *; Manufacturer Part Number 1: *
SW5 SW6 = Generic6X6: as SW1 on sheet MCU1 RP2350B; Manufacturer Part Number 1: *; Package: 4.5X4.5
U3 = STM32G474RE: 512KB 1.71V~3.6V ARM-M4 128KB 170MHz FLASH 52 LQFP-64(10x10) Microcontrollers (MCU/MPU/SOC) ROHS; Manufacturer 1: STMicroelectronics; Manufacturer Part Number 1: STM32G474RET6; Value: *; Package: LQFP-64(10x10)
X2 = ABM8: as X1 on sheet MCU1 RP2350B

## Sheet MODEM_PT1.SchDoc: MODEM PERIPHERALS
size 420 x 297 mm; SheetNumber: 7; SheetTotal: 8
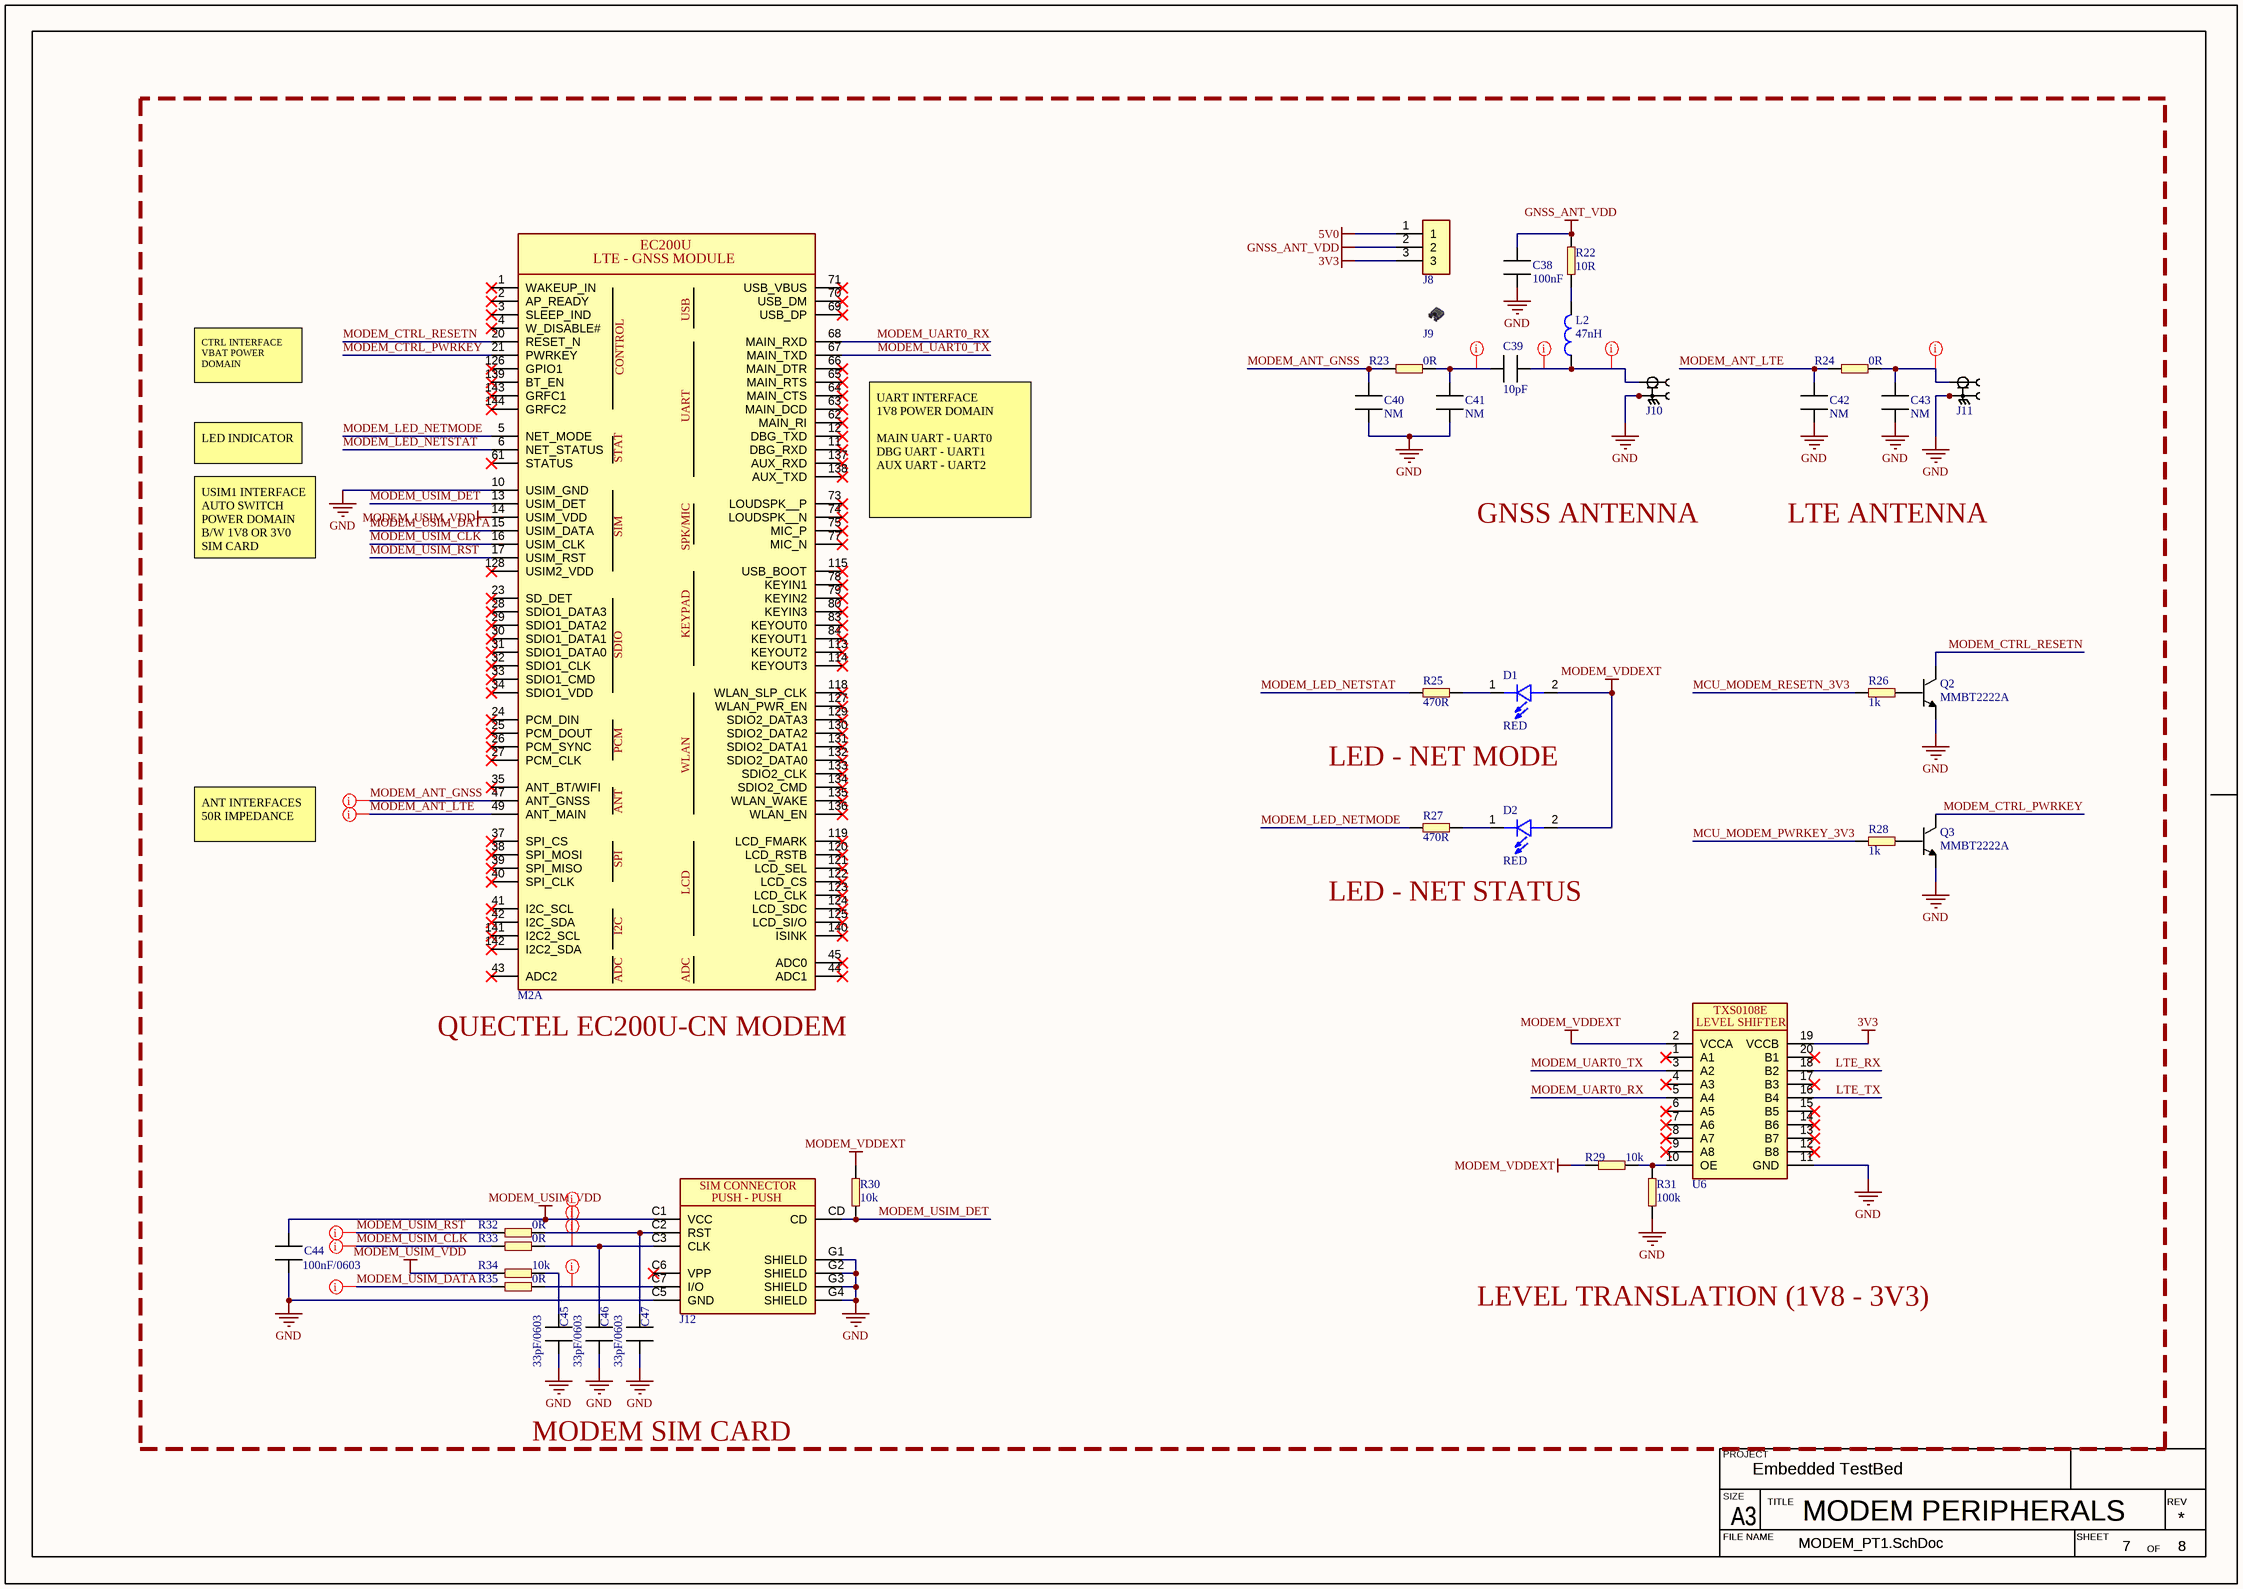
[diagram p4: MODEM_PT1.SchDoc]

### Parts
C38  value 100nF  [CAPC2012X13L]  (hidden comment: MLCC_0805)  (no BOM)
C39  value 10pF  [CAPC0603X03L]  (hidden comment: ERP_102-1)
C40  value NM  [CAPC0603X03L]  (hidden comment: ERP_102-1)  (no BOM)
C41  value NM  [CAPC0603X03L]  (hidden comment: ERP_102-1)  (no BOM)
C42  value NM  [CAPC0603X03L]  (hidden comment: ERP_102-1)  (no BOM)
C43  value NM  [CAPC0603X03L]  (hidden comment: ERP_102-1)  (no BOM)
C44  value 100nF/0603  [CAPC1608X10N]  (hidden comment: ERP_102-1)
C45  value 33pF/0603  [CAPC1608X10N]  (hidden comment: ERP_102-1)
C46  value 33pF/0603  [CAPC1608X10N]  (hidden comment: ERP_102-1)
C47  value 33pF/0603  [CAPC1608X10N]  (hidden comment: ERP_102-1)
D1  value RED  [LED_1206]  (hidden comment: LED_1206)
D2  value RED  [LED_1206]  (hidden comment: LED_1206)
J8  3PX1R_M  [3PX1R_THT]  (value not drawn)
J9  Jumper Cap  [Jumper Cap]  (value not drawn)
J10  ERP_148-1  [uFL_50R]  (value not drawn)
J11  ERP_148-1  [uFL_50R]  (value not drawn)
J12  MUP-7801-1  [MUP-7801-1]  (value not drawn)
L2  value 47nH  [IND_0603]  (hidden comment: ERP_103-3)
M2  EC200U  [EC200U]  (value not drawn)  (part A of 2)
Q2  value MMBT2222A  [MMBT2222]  (hidden comment: ERP_105-1)
Q3  value MMBT2222A  [MMBT2222]  (hidden comment: ERP_105-1)
R22  value 10R  [RES_0603]  (hidden comment: ERP_101-1)
R23  value 0R  [RESC0603X03L]  (hidden comment: ERP_101-1)
R24  value 0R  [RESC0603X03L]  (hidden comment: ERP_101-1)
R25  value 470R  [RES_0603]  (hidden comment: ERP_101-1)
R26  value 1k  [RES_0603]  (hidden comment: ERP_101-1)
R27  value 470R  [RES_0603]  (hidden comment: ERP_101-1)
R28  value 1k  [RES_0603]  (hidden comment: ERP_101-1)
R29  value 10k  [RES_0603]  (hidden comment: ERP_101-1)
R30  value 10k  [RES_0603]  (hidden comment: ERP_101-1)
R31  value 100k  [RES_0603]  (hidden comment: ERP_101-1)
R32  value 0R  [RES_0603]  (hidden comment: ERP_101-1)
R33  value 0R  [RES_0603]  (hidden comment: ERP_101-1)
R34  value 10k  [RES_0603]  (hidden comment: ERP_101-1)
R35  value 0R  [RES_0603]  (hidden comment: ERP_101-1)
U6  TXS0108EPW  [TXS0108EPW]  (value not drawn)

### Nets
3V3: J8.3 U6.19(VCCB)
5V0: J8.1
GND: C38.2 C40.1 C41.1 C42.1 C43.1 C44.2 C45.2 C46.2 C47.2 J10.1 J10.2 J11.1 J11.2 J12.C5(GND) J12.G1(SHIELD) J12.G2(SHIELD) J12.G3(SHIELD) J12.G4(SHIELD) M2.10(USIM_GND) Q2.2 Q3.2 R31.2 U6.11(GND)
GNSS_ANT_VDD: C38.1 J8.2 R22.2
MODEM_USIM_VDD: C44.1 J12.C1(VCC) M2.14(USIM_VDD) R34.2
MODEM_VDDEXT: D1.2 D2.2 R29.2 R30.2 U6.2(VCCA)
LTE_RX: U6.18(B2)
LTE_TX: U6.16(B4)
MCU_MODEM_PWRKEY_3V3: R28.2
MCU_MODEM_RESETN_3V3: R26.2
MODEM_ANT_GNSS: C40.2 M2.47(ANT_GNSS) R23.2
MODEM_ANT_LTE: C42.2 M2.49(ANT_MAIN) R24.2
MODEM_CTRL_PWRKEY: M2.21(PWRKEY) Q3.3
MODEM_CTRL_RESETN: M2.20(RESET_N) Q2.3
MODEM_LED_NETMODE: M2.5(NET_MODE) R27.2
MODEM_LED_NETSTAT: M2.6(NET_STATUS) R25.2
MODEM_UART0_RX: M2.68(MAIN_RXD) U6.5(A4)
MODEM_UART0_TX: M2.67(MAIN_TXD) U6.3(A2)
MODEM_USIM_CLK: M2.16(USIM_CLK) R33.2
MODEM_USIM_DATA: M2.15(USIM_DATA) R35.2
MODEM_USIM_DET: J12.CD M2.13(USIM_DET) R30.1
MODEM_USIM_RST: M2.17(USIM_RST) R32.2
NetC39_1: C39.1 J10.3 L2.1
NetC39_2: C39.2 C41.2 R23.1
NetC43_2: C43.2 J11.3 R24.1
NetC45_1: C45.1 R34.1
NetC46_1: C46.1 J12.C3(CLK) R33.1
NetC47_1: C47.1 J12.C2(RST) R32.1
NetD1_1: D1.1 R25.1
NetD2_1: D2.1 R27.1
NetJ12_C7: J12.C7(I/O) R35.1
NetL2_2: L2.2 R22.1
NetQ2_1: Q2.1 R26.1
NetQ3_1: Q3.1 R28.1
NetR29_1: R29.1 R31.1 U6.10(OE)

Not connected (* = marked no-connect by the designer): J12 C6(VPP)*; M2 1(WAKEUP_IN)* 2(AP_READY)* 3(SLEEP_IND)* 4(W_DISABLE#)* 11(DBG_RXD)* 12(DBG_TXD)* 23(SD_DET)* 24(PCM_DIN)* 25(PCM_DOUT)* 26(PCM_SYNC)* 27(PCM_CLK)* 28(SDIO1_DATA3)* 29(SDIO1_DATA2)* 30(SDIO1_DATA1)* 31(SDIO1_DATA0)* 32(SDIO1_CLK)* 33(SDIO1_CMD)* 34(SDIO1_VDD)* 35(ANT_BT/WIFI)* 37(SPI_CS)* 38(SPI_MOSI)* 39(SPI_MISO)* 40(SPI_CLK)* 41(I2C_SCL)* 42(I2C_SDA)* 43(ADC2)* 44(ADC1)* 45(ADC0)* 61(STATUS)* 62(MAIN_RI)* 63(MAIN_DCD)* 64(MAIN_CTS)* 65(MAIN_RTS)* 66(MAIN_DTR)* 69(USB_DP)* 70(USB_DM)* 71(USB_VBUS)* 73(LOUDSPK__P)* 74(LOUDSPK__N)* 75(MIC_P)* 77(MIC_N)* 78(KEYIN1)* 79(KEYIN2)* 80(KEYIN3)* 83(KEYOUT0)* 84(KEYOUT1)* 113(KEYOUT2)* 114(KEYOUT3)* 115(USB_BOOT)* 118(WLAN_SLP_CLK)* 119(LCD_FMARK)* 120(LCD_RSTB)* 121(LCD_SEL)* 122(LCD_CS)* 123(LCD_CLK)* 124(LCD_SDC)* 125(LCD_SI/O)* 126(GPIO1)* 127(WLAN_PWR_EN)* 128(USIM2_VDD)* 129(SDIO2_DATA3)* 130(SDIO2_DATA2)* 131(SDIO2_DATA1)* 132(SDIO2_DATA0)* 133(SDIO2_CLK)* 134(SDIO2_CMD)* 135(WLAN_WAKE)* 136(WLAN_EN)* 137(AUX_RXD)* 138(AUX_TXD)* 139(BT_EN)* 140(ISINK)* 141(I2C2_SCL)* 142(I2C2_SDA)* 143(GRFC1)* 144(GRFC2)*; U6 1(A1)* 4(A3)* 6(A5)* 7(A6)* 8(A7)* 9(A8)* 12(B8)* 13(B7)* 14(B6)* 15(B5)* 17(B3)* 20(B1)*

### Layout directives
net class ANT_50R; rule Width Constraint [Pref Impedance = 50.00ohms    Min Impedance = 50.00ohms    Max Impedance = 50.00ohms]: MODEM_ANT_GNSS, MODEM_ANT_LTE, NetC39_1, NetC39_2, NetC43_2
rule Width Constraint [Pref Impedance = 50.00ohms    Min Impedance = 50.00ohms    Max Impedance = 50.00ohms]: MODEM_USIM_CLK, MODEM_USIM_DATA, MODEM_USIM_RST, NetC46_1, NetJ12_C7
rule Width Constraint [Pref Width = 0.366mm    Min Width = 0.183mm    Max Width = 0.366mm]: NetC47_1
rule Width Constraint [Pref Width = 0.5mm    Min Width = 0.335mm    Max Width = 1mm]: MODEM_USIM_VDD

### Notes on the sheet
- CTRL INTERFACE
  VBAT POWER DOMAIN
- LED INDICATOR
- UART INTERFACE
  1V8 POWER DOMAIN
  MAIN UART - UART0
  DBG UART - UART1
  AUX UART - UART2
- GNSS ANTENNA
- LTE ANTENNA
- USIM1 INTERFACE
  AUTO SWITCH POWER DOMAIN B/W 1V8 OR 3V0 SIM CARD
- LED - NET MODE
- ANT INTERFACES
  50R IMPEDANCE
- LED - NET STATUS
- (near M2) QUECTEL EC200U-CN MODEM
- LEVEL TRANSLATION (1V8 - 3V3)
- MODEM SIM CARD
- PROJECT
- SIZE
- FILE NAME
- A3
- TITLE
- SHEET
- OF
- REV
- (in symbol EC200U, part A) LTE - GNSS MODULE; USB; CONTROL; UART; STAT; SIM; SPK/MIC; KEYPAD; SDIO; PCM; WLAN; ANT; SPI; LCD; I2C; ADC
- (in symbol MUP-7801-1) SIM CONNECTOR; PUSH - PUSH
- (in symbol TXS0108EPW) TXS0108E; LEVEL SHIFTER

### Library data of the parts
C38 = MLCC_0805: as C3 on sheet MCU1 RP2350B; Package: 0805; Manufacturer 1: *; Manufacturer Part Number 1: *
C39-C43 = MLCC_0201: Chip Capacitor, 2-Leads, Body 0.60x0.30mm, IPC High Density; Package: 0201; Manufacturer 1: *; Manufacturer Part Number 1: *
C44-C47 = MLCC_0603: as C1 on sheet MCU1 RP2350B; Package: 0603; Manufacturer 1: *; Manufacturer Part Number 1: *
D1 D2 = LED_1206: LED CLEAR 1206 SMD; Manufacturer Part Number 1: 6395; Manufacturer 1: Sunrom
J8 = 3PX1R_M: 3PX1R Male Header; Value: C49257; Manufacturer 1: *; Manufacturer Part Number 1: *
J9 = Jumper Cap: 2 Pin Jumper Cap P2.54; Manufacturer Part Number 1: *; Manufacturer 1: *; Value: *
J10 J11 = uFL_50R: Package: L3W3; Value: *; ERP: *; Manufacturer 1: *; Manufacturer Part Number 1: *; Supplier 1: *; Suuplier Part Number 1: *
J12 = MUP-7801-1: 7 (6 + 1) Position Card Connector NANO SIM Surface Mount, Right Angle Gold; Manufacturer Part Number 1: MUP-C7801-02; Manufacturer 1: MUP; Package: 7 (6 + 1); Value: *; Supplier Part Number 1: ST2103SD1921
L2 = IND_0603: ERP: *; Suuplier Part Number 1: *; Supplier 1: *; Manufacturer Part Number 1: *; Manufacturer 1: *; Package: 0603
M2 = EC200U: LTE CAT1 MODEM 144 SMD; Manufacturer 1: Quectel; Manufacturer Part Number 1: 027-EC200UCNAA-N05-SGNSA; Value: *
Q2 Q3 = MMBT2222: MMBT2222A; ERP: *; Suuplier Part Number 1: *; Supplier 1: *; Manufacturer Part Number 1: *; Manufacturer 1: *; Package: SOT23
R22 R25-R35 = RES_0603: Package: 0603; Manufacturer 1: *; Manufacturer Part Number 1: *
  R25-R28: ERP: *
R23 R24 = RES_0201: Package: 0201; Manufacturer 1: *; Manufacturer Part Number 1: *
U6 = TXS0108EPW: Voltage Level Translator Bidirectional 1 Circuit 8 Channel 60Mbps 20-TSSOP; Manufacturer Part Number 1: TXS0108EPWR; Manufacturer 1: Texas Instruments; Package: 20-TSSOP; Value: *

## Sheet MODEM_PT2.SchDoc: MODEM POWER
size 420 x 297 mm; SheetNumber: 8; SheetTotal: 8
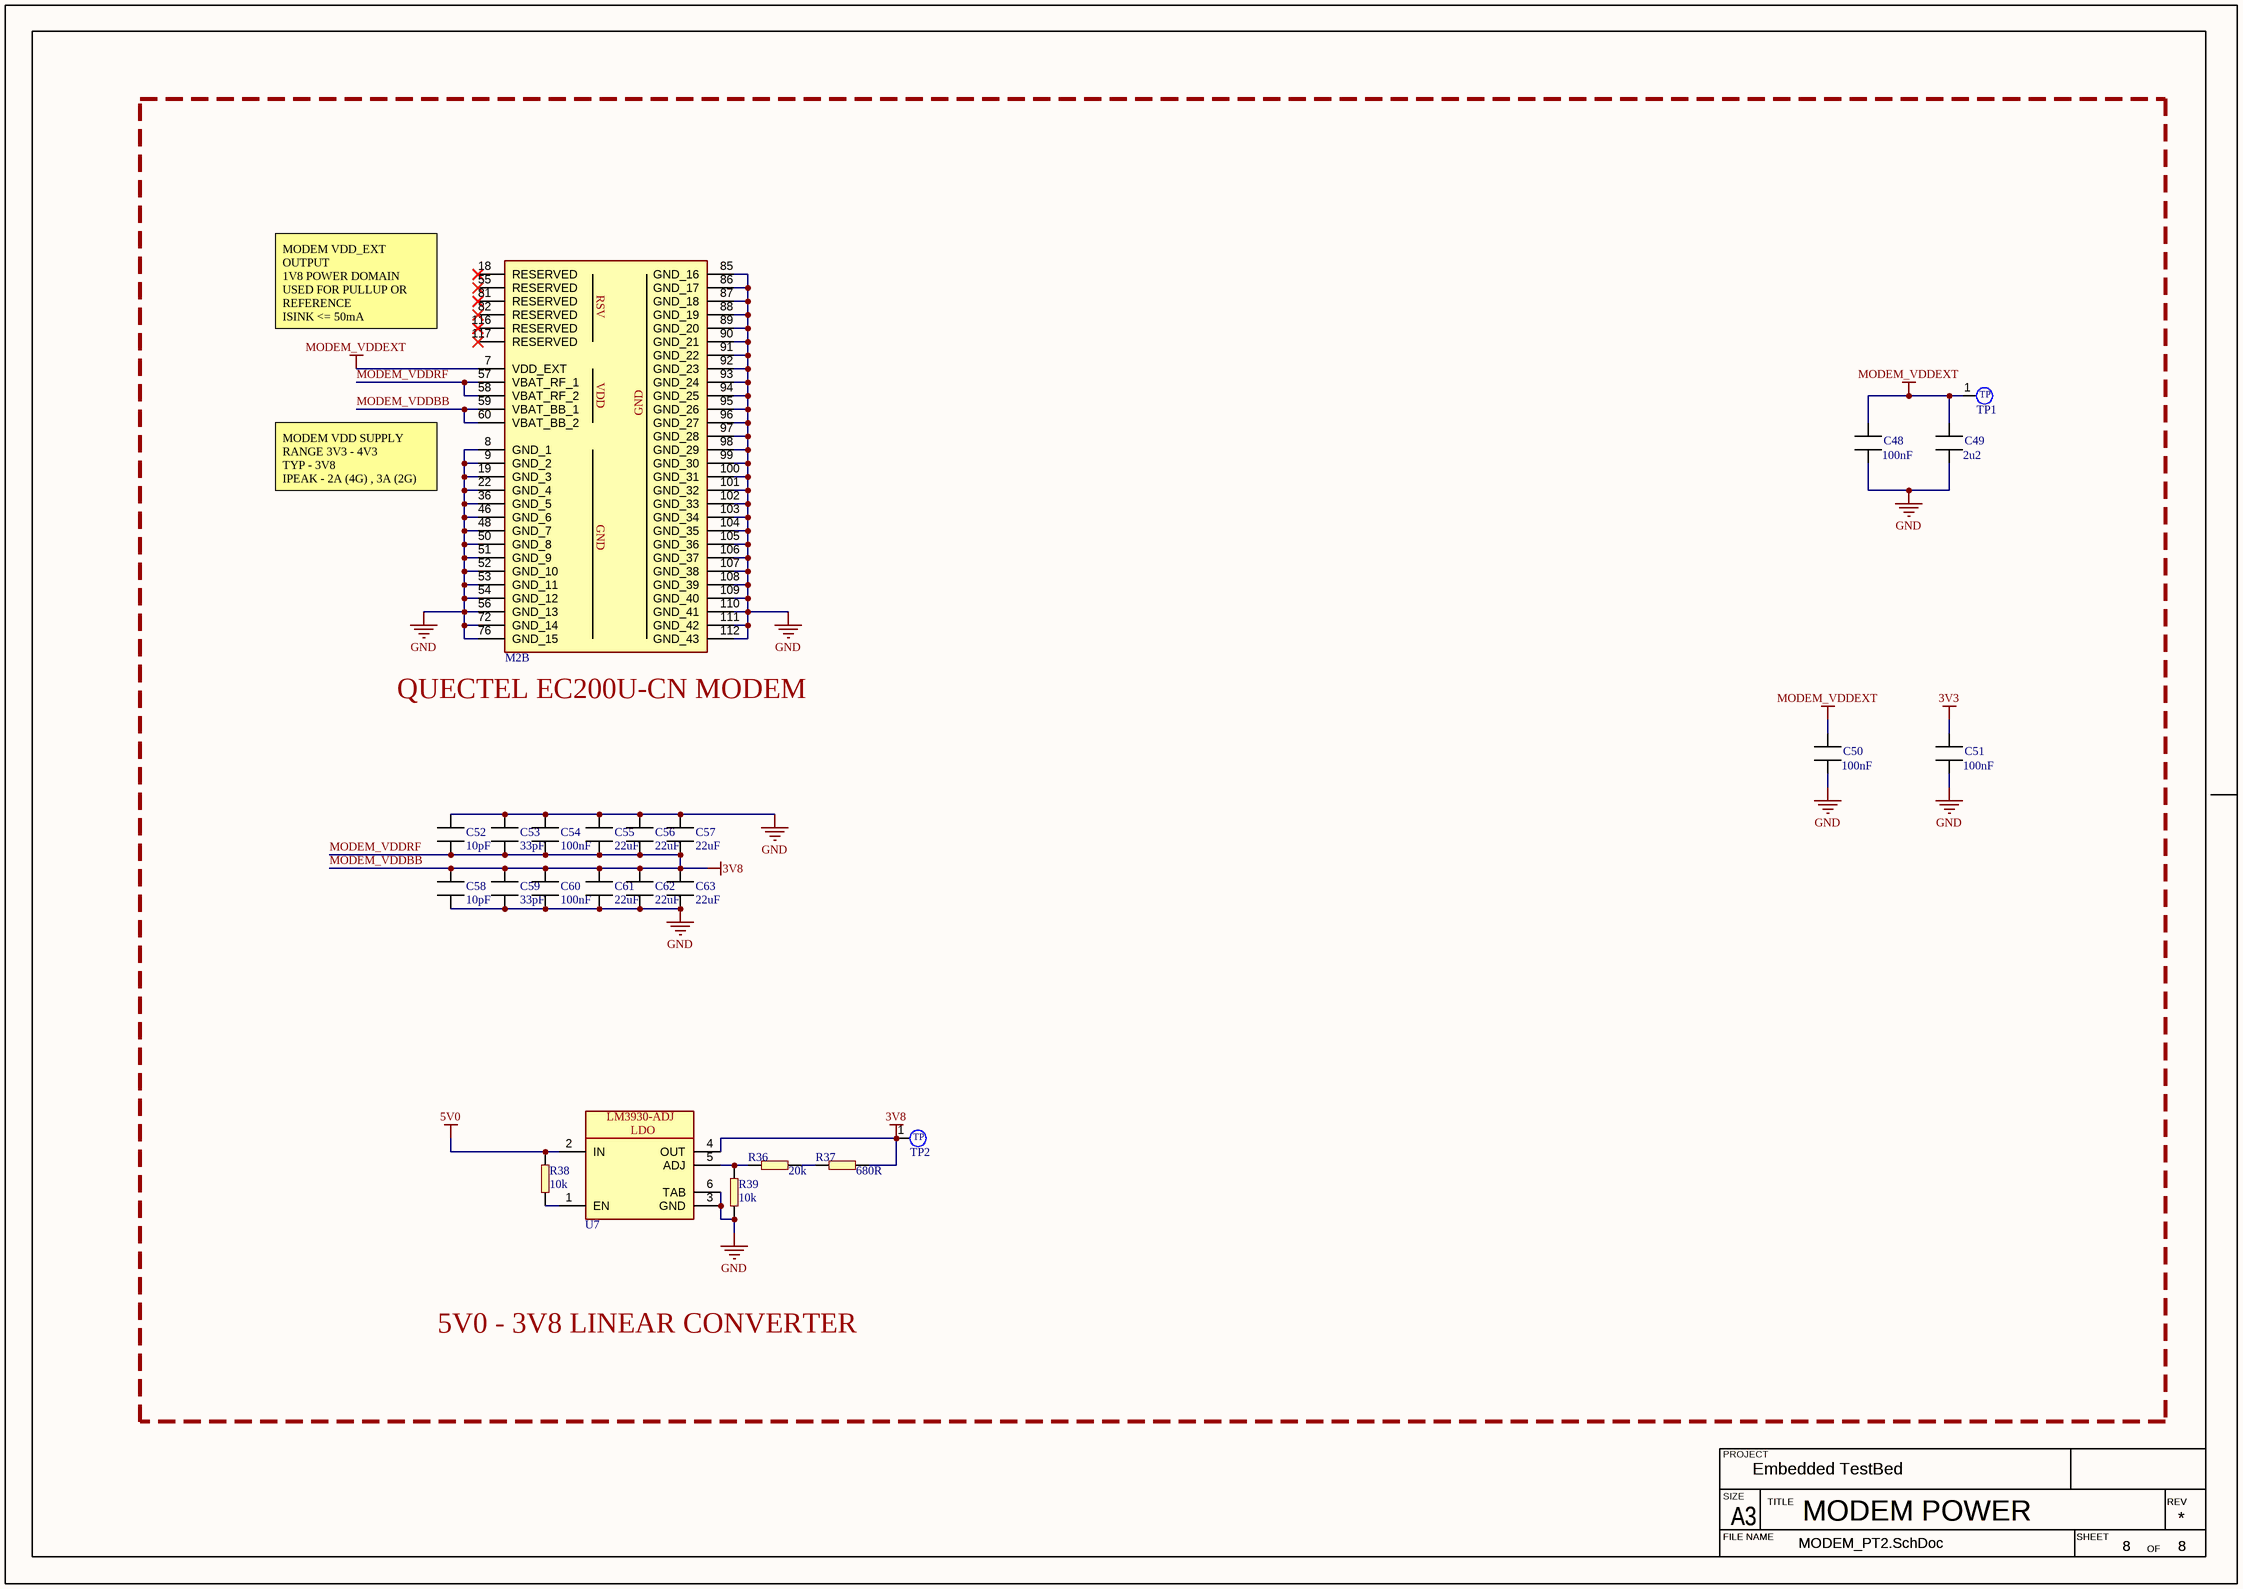
[diagram p5: MODEM_PT2.SchDoc]

### Parts
C48  value 100nF  [CAPC2012X13L]  (hidden comment: MLCC_0805)
C49  value 2u2  [CAPC2012X13L]  (hidden comment: MLCC_0805)
C50  value 100nF  [CAPC2012X13L]  (hidden comment: MLCC_0805)
C51  value 100nF  [CAPC2012X13L]  (hidden comment: MLCC_0805)
C52  value 10pF  [CAPC2012X13L]  (hidden comment: MLCC_0805)
C53  value 33pF  [CAPC2012X13L]  (hidden comment: MLCC_0805)
C54  value 100nF  [CAPC2012X13L]  (hidden comment: MLCC_0805)
C55  value 22uF  [CAPC2012X13L]  (hidden comment: MLCC_0805)
C56  value 22uF  [CAPC2012X13L]  (hidden comment: MLCC_0805)
C57  value 22uF  [CAPC2012X13L]  (hidden comment: MLCC_0805)
C58  value 10pF  [CAPC2012X13L]  (hidden comment: MLCC_0805)
C59  value 33pF  [CAPC2012X13L]  (hidden comment: MLCC_0805)
C60  value 100nF  [CAPC2012X13L]  (hidden comment: MLCC_0805)
C61  value 22uF  [CAPC2012X13L]  (hidden comment: MLCC_0805)
C62  value 22uF  [CAPC2012X13L]  (hidden comment: MLCC_0805)
C63  value 22uF  [CAPC2012X13L]  (hidden comment: MLCC_0805)
M2  EC200U  [EC200U]  (value not drawn)  (part B of 2)
R36  value 20k  [RES_0603]  (hidden comment: ERP_101-1)
R37  value 680R  [RES_0603]  (hidden comment: ERP_101-1)
R38  value 10k  [RES_0603]  (hidden comment: ERP_101-1)
R39  value 10k  [RES_0603]  (hidden comment: ERP_101-1)
TP1  TP_1MM  [TP_1MM]  (value not drawn)  (no BOM)
TP2  TP_1MM  [TP_1MM]  (value not drawn)  (no BOM)
U7  LM39302  [DPAK170P1491X483-6N]  (value not drawn)

### Nets
3V3: C51.1
5V0: R38.1 U7.2(IN)
GND: C48.2 C49.2 C50.2 C51.2 C52.1 C53.1 C54.1 C55.1 C56.1 C57.1 C58.2 C59.2 C60.2 C61.2 C62.2 C63.2 M2.8(GND_1) M2.9(GND_2) M2.19(GND_3) M2.22(GND_4) M2.36(GND_5) M2.46(GND_6) M2.48(GND_7) M2.50(GND_8) M2.51(GND_9) M2.52(GND_10) M2.53(GND_11) M2.54(GND_12) M2.56(GND_13) M2.72(GND_14) M2.76(GND_15) M2.85(GND_16) M2.86(GND_17) M2.87(GND_18) M2.88(GND_19) M2.89(GND_20) M2.90(GND_21) M2.91(GND_22) M2.92(GND_23) M2.93(GND_24) M2.94(GND_25) M2.95(GND_26) M2.96(GND_27) M2.97(GND_28) M2.98(GND_29) M2.99(GND_30) M2.100(GND_31) M2.101(GND_32) M2.102(GND_33) M2.103(GND_34) M2.104(GND_35) M2.105(GND_36) M2.106(GND_37) M2.107(GND_38) M2.108(GND_39) M2.109(GND_40) M2.110(GND_41) M2.111(GND_42) M2.112(GND_43) R39.2 U7.3(GND) U7.6(TAB)
MODEM_VDDBB: C52.2 C53.2 C54.2 C55.2 C56.2 C57.2 C58.1 C59.1 C60.1 C61.1 C62.1 C63.1 M2.57(VBAT_RF_1) M2.58(VBAT_RF_2) M2.59(VBAT_BB_1) M2.60(VBAT_BB_2) R37.1 TP2.1 U7.4(OUT)  [also labelled 3V8, MODEM_VDDRF]
MODEM_VDDEXT: C48.1 C49.1 C50.1 M2.7(VDD_EXT) TP1.1
NetR36_1: R36.1 R37.2
NetR36_2: R36.2 R39.1 U7.5(ADJ)
NetR38_2: R38.2 U7.1(EN)

Not connected (* = marked no-connect by the designer): M2 18(RESERVED)* 55(RESERVED)* 81(RESERVED)* 82(RESERVED)* 116(RESERVED)* 117(RESERVED)*

### Notes on the sheet
- MODEM VDD_EXT OUTPUT
  1V8 POWER DOMAIN
  USED FOR PULLUP OR REFERENCE
  ISINK <= 50mA
- MODEM VDD SUPPLY
  RANGE 3V3 - 4V3
  TYP - 3V8
  IPEAK - 2A (4G) , 3A (2G)
- (near M2) QUECTEL EC200U-CN MODEM
- 5V0 - 3V8 LINEAR CONVERTER
- PROJECT
- SIZE
- FILE NAME
- A3
- TITLE
- SHEET
- OF
- REV
- (in symbol EC200U, part B) RSV; VDD; GND
- (in symbol LM39302) LM3930-ADJ; LDO
- (in symbol TP_1MM) TP

### Library data of the parts
C48-C63 = MLCC_0805: as C3 on sheet MCU1 RP2350B; Package: 0805; Manufacturer 1: *; Manufacturer Part Number 1: *
M2 = EC200U: as M2 on sheet MODEM_PT1; Value: *
R36-R39 = RES_0603: Package: 0603; Manufacturer 1: *; Manufacturer Part Number 1: *; ERP: *
U7 = LM39302: LM39302R HTC TO263 - Adjustable 3A Low-Voltage Low-Dropout Regulator; Manufacturer Part Number 1: *; Manufacturer 1: *; Value: *

## Sheet CAN.SchDoc: MCP2515 CAN BUS
size 420 x 297 mm; SheetNumber: 6; SheetTotal: 8
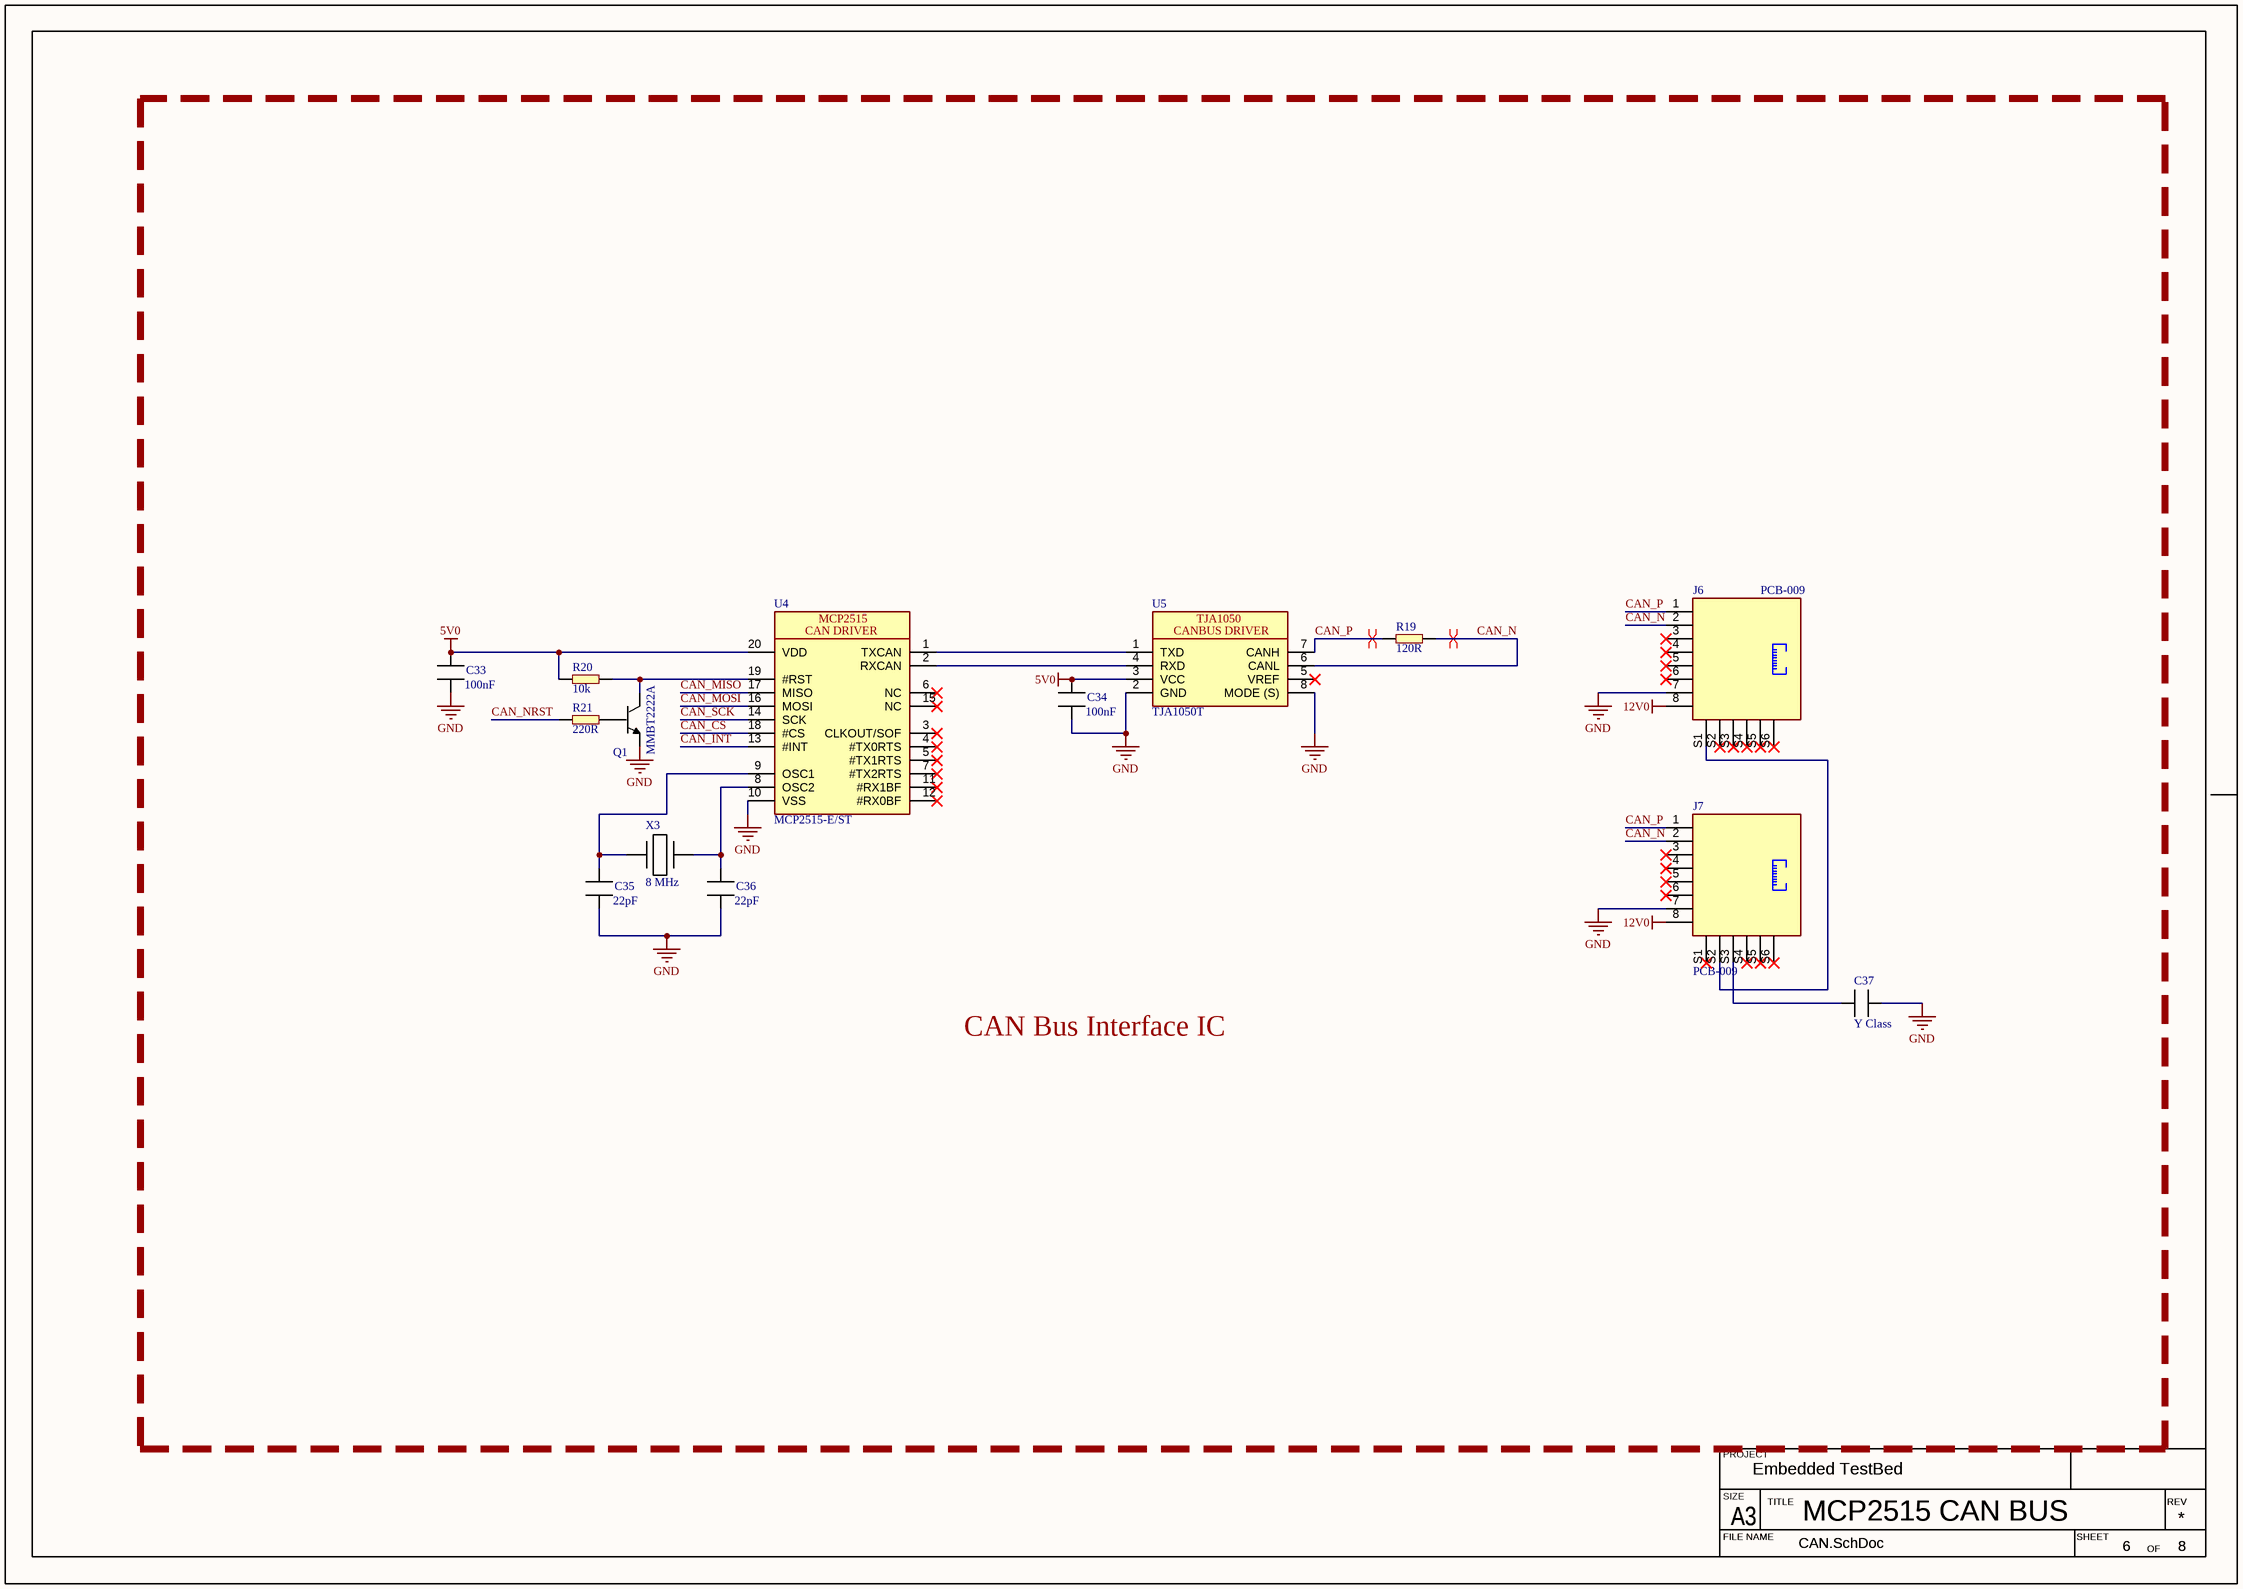
[diagram p6: CAN.SchDoc]

### Parts
C33  value 100nF  [CAPC2012X13L]  (hidden comment: MLCC_0805)
C34  value 100nF  [CAPC2012X13L]  (hidden comment: MLCC_0805)
C35  value 22pF  [CAPC2012X13L]  (hidden comment: MLCC_0805)
C36  value 22pF  [CAPC2012X13L]  (hidden comment: MLCC_0805)
C37  value Y Class  [VY1222M43Y5UC63V0]  (hidden comment: VY1)
J6  value PCB-009  [PCB-009]  (hidden comment: ERP_148-3)
J7  value PCB-009  [PCB-009]  (hidden comment: ERP_148-3)
Q1  value MMBT2222A  [MMBT2222]  (hidden comment: ERP_105-1)
R19  value 120R  [RES_0603]  (hidden comment: ERP_101-1)
R20  value 10k  [RES_0603]  (hidden comment: ERP_101-1)
R21  value 220R  [RES_0603]  (hidden comment: ERP_101-1)
U4  value MCP2515-E/ST  [MCP2515-ST]  (hidden comment: MCP2515)
U5  value TJA1050T  [TJA1050T]  (hidden comment: TJA1050)
X3  value 8 MHz  [HC-49US]  (hidden comment: HC-49US)

### Blocks framed on the sheet
CAN Bus Interface IC: C33-C37 J6 J7 Q1 R19-R21 U4 U5 X3

### Nets
5V0: C33.1 C34.1 R20.1 U4.20(VDD) U5.3(VCC)
12V0: J6.8 J7.8
GND: C33.2 C34.2 C35.2 C36.2 C37.2 J6.7 J7.7 Q1.2 U4.10(VSS) U5.2(GND) U5.8(MODE_(S))
CAN_CS: U4.18(#CS)
CAN_INT: U4.13(#INT)
CAN_MISO: U4.17(MISO)
CAN_MOSI: U4.16(MOSI)
CAN_N: J6.2 J7.2 R19.2 U5.6(CANL)
CAN_NRST: R21.1
CAN_P: J6.1 J7.1 R19.1 U5.7(CANH)
CAN_SCK: U4.14(SCK)
NetC35_1: C35.1 U4.9(OSC1) X3.1
NetC36_1: C36.1 U4.8(OSC2) X3.2
NetC37_1: C37.1 J7.S3
NetJ6_S1: J6.S1 J7.S2
NetQ1_1: Q1.1 R21.2
NetQ1_3: Q1.3 R20.2 U4.19(#RST)
NetU4_1: U4.1(TXCAN) U5.1(TXD)
NetU4_2: U4.2(RXCAN) U5.4(RXD)

Not connected (* = marked no-connect by the designer): J6 3* 4* 5* 6* S2* S3* S4* S5* S6*; J7 3* 4* 5* 6* S1* S4* S5* S6*; U4 3(CLKOUT/SOF)* 4(#TX0RTS)* 5(#TX1RTS)* 6(NC)* 7(#TX2RTS)* 11(#RX1BF)* 12(#RX0BF)* 15(NC)*; U5 5(VREF)*

### Layout directives
differential pair; differential pair class CAN_120R; rule Differential Pairs Routing [Pref Gap = 10mil    Min Gap  = 10mil    Max Gap  = 10milPref Width = 16.535mil    Min Width  = 16.535mil    Max Width  = 16.535mil]: CAN_N, CAN_P

### Notes on the sheet
- PROJECT
- SIZE
- FILE NAME
- A3
- TITLE
- SHEET
- OF
- REV
- (in symbol MCP2515) CAN DRIVER
- (in symbol TJA1050) CANBUS DRIVER

### Library data of the parts
C33-C36 = MLCC_0805: as C3 on sheet MCU1 RP2350B; Package: 0805; Manufacturer 1: *; Manufacturer Part Number 1: *
C37 = VY1: Ceramic Capacitor Y5U (E) Radial, Disc; Manufacturer 1: *; Manufacturer Part Number 1: *
J6 J7 = RJ45_Top_Entry: PCB-009 Robu; Manufacturer Part Number 1: *; Manufacturer 1: *; Supplier Part Number 1: *; Supplier 1: *; ERP: *; Package: 8P8C
Q1 = MMBT2222: MMBT2222A; ERP: *; Suuplier Part Number 1: *; Supplier 1: *; Manufacturer Part Number 1: *; Manufacturer 1: *; Package: SOT23
R19 = RES_0603: Manufacturer Part Number 1: 560112116003; Package: 0603; Manufacturer 1: *
R20 R21 = RES_0603: Package: 0603; Manufacturer 1: *; Manufacturer Part Number 1: *
U4 = MCP2515: CAN Interface IC; Manufacturer 1: *; Manufacturer Part Number 1: *
U5 = TJA1050: CAN Transceiver IC; Manufacturer 1: *; Manufacturer Part Number 1: *
X3 = HC-49US: CRYSTAL HC-49US 2 Pin; Package: HC-49US; ERP: *; Manufacturer Part Number 1: *; Manufacturer 1: *

## Nets that join several sheets
3V3: MCU1 RP2350B (34 pins), MCU2 (10 pins), MCU3 (20 pins), MODEM_PT1 (J8.3 U6.19), MODEM_PT2 (C51.1)
5V0: MCU1 RP2350B (J1.21 J1.22 J2.21 J2.22), MCU2 (J3.21 J3.22), MCU3 (J4.21 J4.22 J5.21 J5.22), MODEM_PT1 (J8.1), MODEM_PT2 (R38.1 U7.2), CAN (5 pins)
GND: MCU1 RP2350B (42 pins), MCU2 (29 pins), MCU3 (37 pins), MODEM_PT1 (23 pins), MODEM_PT2 (62 pins), CAN (11 pins)
MODEM_VDDEXT: MODEM_PT1 (5 pins), MODEM_PT2 (5 pins)